# EasyEDA Pro project EMG.eprj

# Schematic schematic diagram
Create Date: 2024-07-17; Page Name: Page 1; Project Name: EMG; Schematic Name: schematic diagram; Update Date: 2024-07-18; Company: University of Leeds; Drawed: Junnan Liu; Page Size: A; Reviewed: Junnan Liu; Version: V1.0
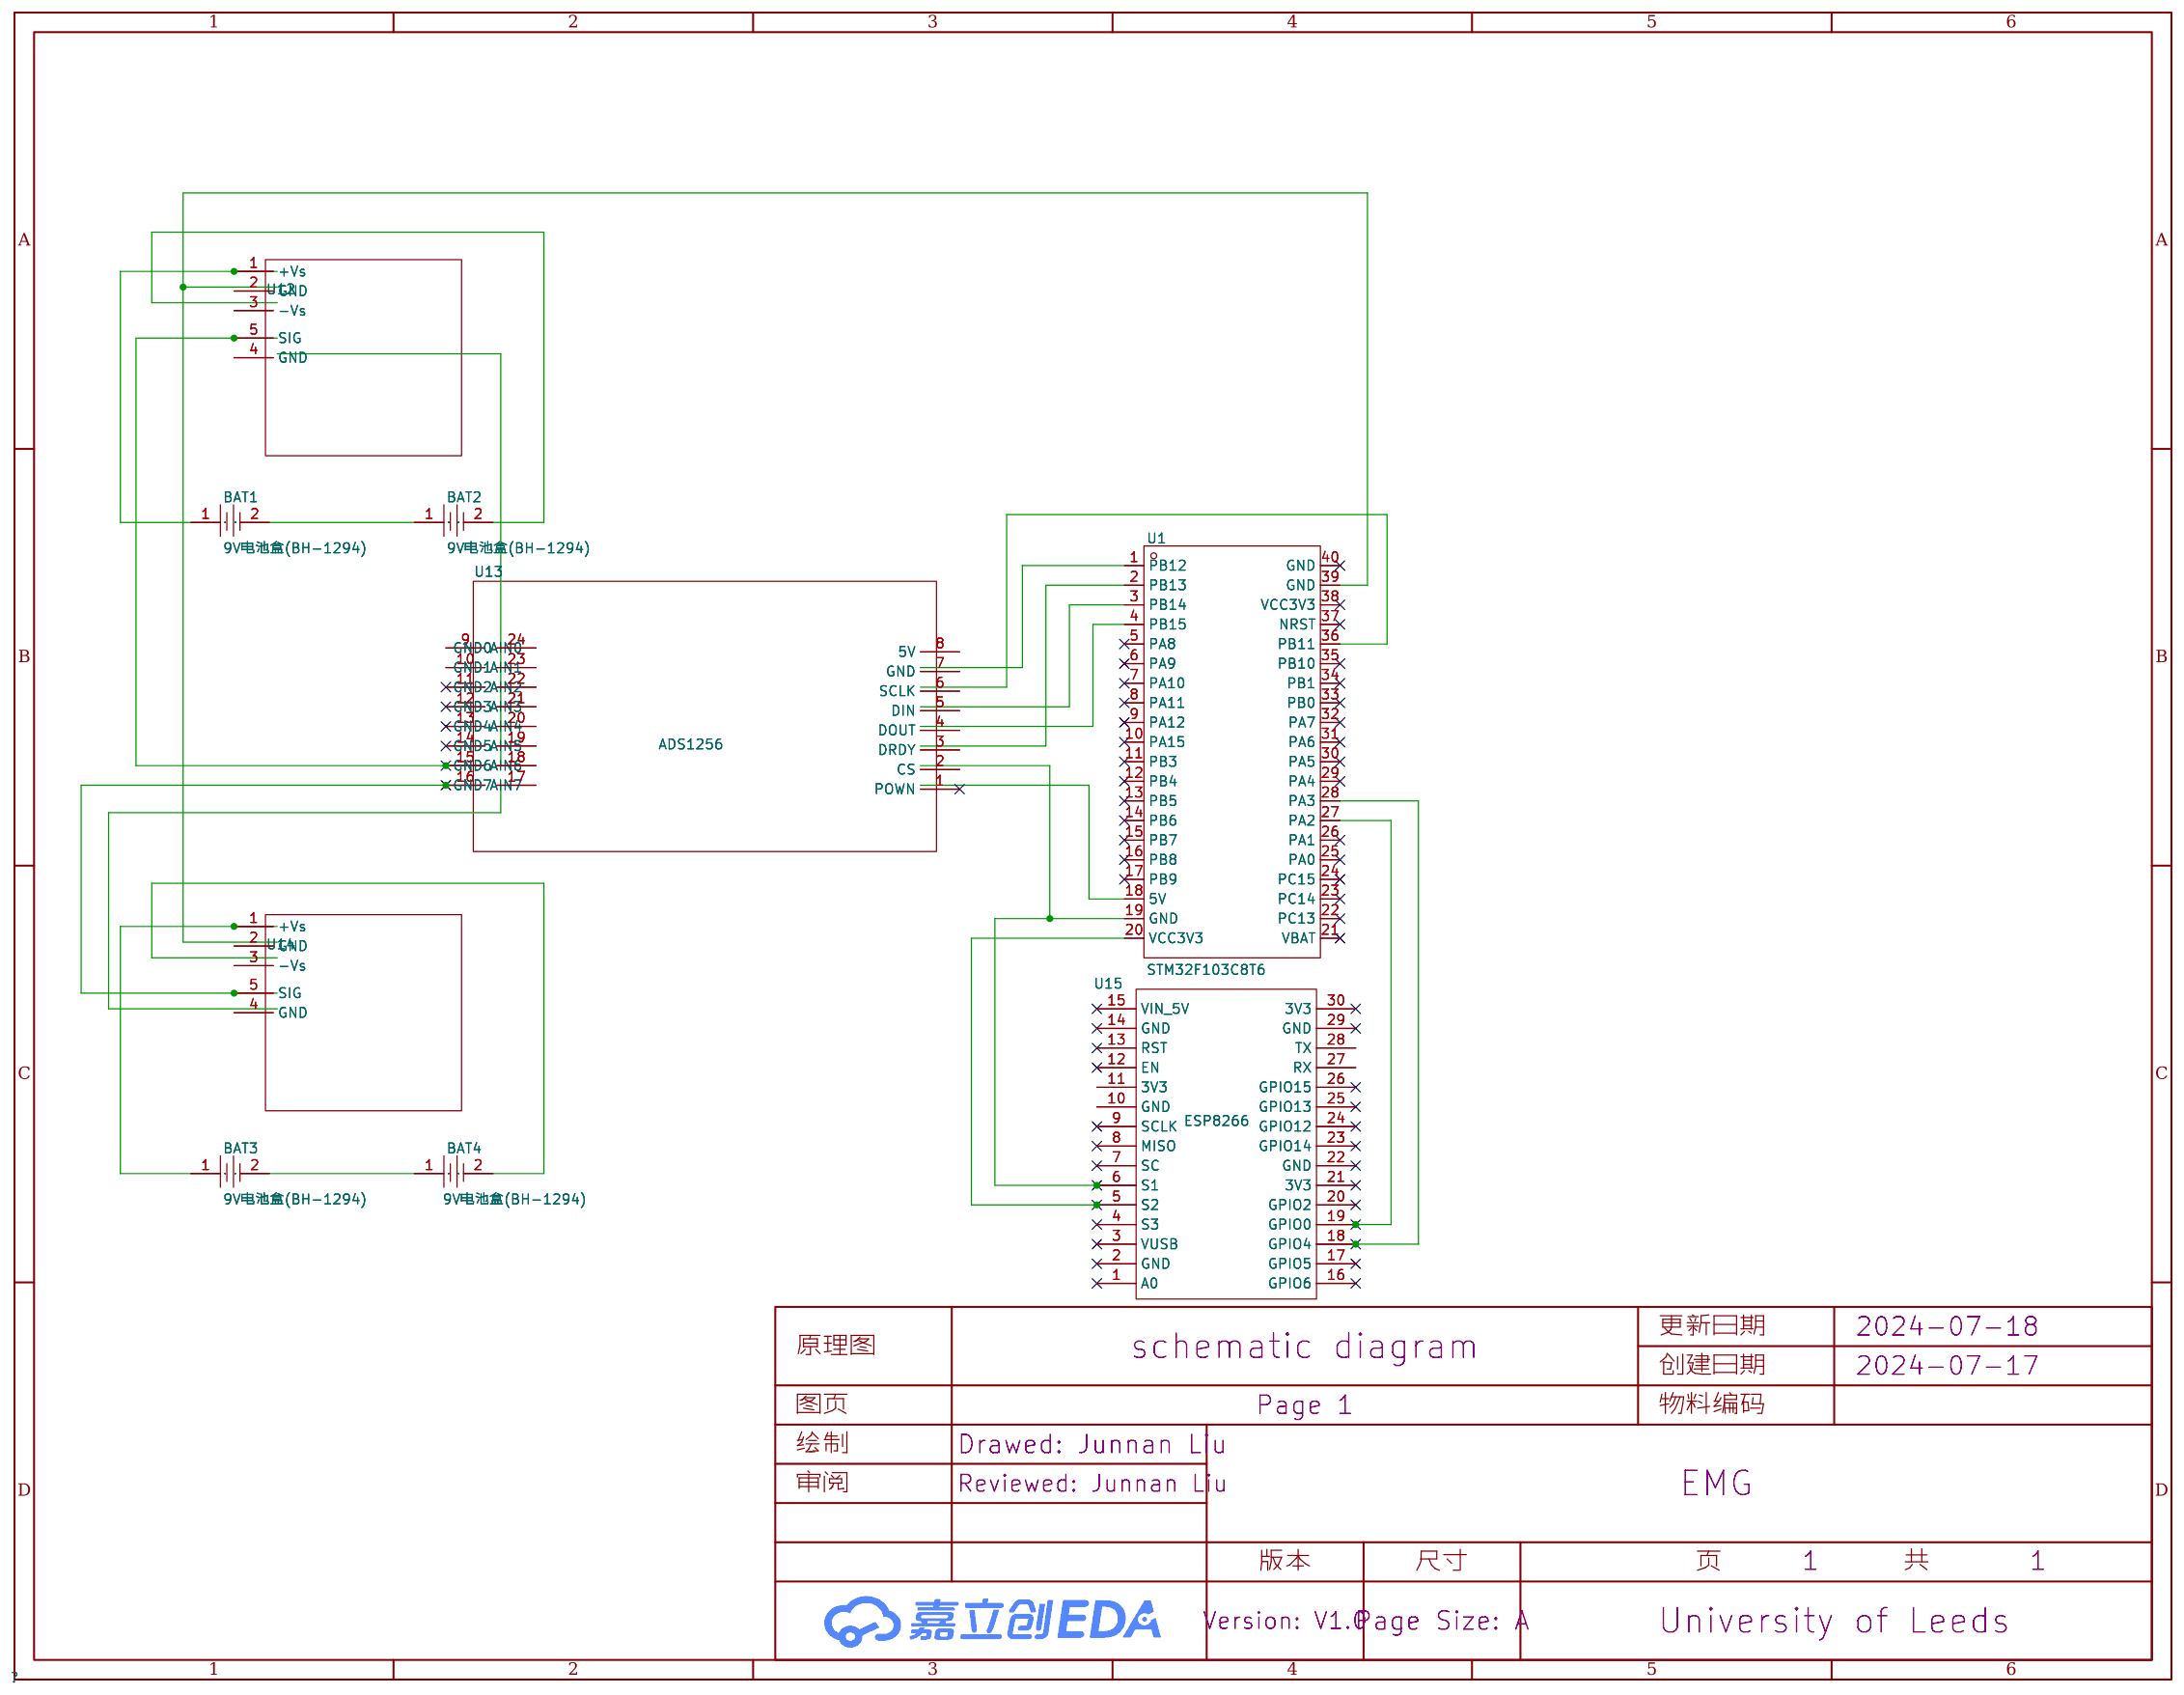
[diagram p0: schematic sheet]

## Parts
BAT1  9V电池盒(BH-1294)  [BAT-TH_BH-1294]
BAT2  9V电池盒(BH-1294)  [BAT-TH_BH-1294]
BAT3  9V电池盒(BH-1294)  [BAT-TH_BH-1294]
BAT4  9V电池盒(BH-1294)  [BAT-TH_BH-1294]
U1  STM32F103C8T6  [CONN-TH_L53.3-W22.9_STM32F103C8T6-CARD]
U12  -  [AD8226]
U13  ADS1256  [ADS1256]
U14  -  [AD8226]
U15  ESP8266  [ESP8266]

## Library data of the parts
BAT1-BAT4 = 9V电池盒(BH-1294): Supplier Part: C2848814; Supplier Footprint: TH-2P; JLCPCB Part Class: 扩展库; Supplier: LCSC
U1 = STM32F103C8T6-Card: Supplier Part: C9900077949; Supplier Footprint: 插件; Supplier: LCSC
U12 U14 = AD8226
U13 = ADS1256
U15 = ESP8266

## Nets
$1N1992: BAT1.2 BAT2.1
$1N2057: BAT1.1 U12.1(+Vs)
$1N2495: BAT3.2 BAT4.1
$1N2497: BAT3.1 U14.1(+Vs)
Net-(U1-19): U1.19(GND) U15.6(S1)
Net-(U1-20): U1.20(VCC3V3) U15.5(S2)
Net-(U1-27): U1.27(PA2) U15.19(GPIO0)
Net-(U1-28): U1.28(PA3) U15.18(GPIO4)
Net-(U12-5): U12.5(SIG) U13.15(AIN6)
Net-(U13-16): U13.16(AIN7) U14.5(SIG)

Not connected (* = marked no-connect by the designer): BAT2 2; BAT4 2; U1 1(PB12) 2(PB13) 3(PB14) 4(PB15) 5(PA8)* 6(PA9)* 7(PA10)* 8(PA11)* 9(PA12)* 10(PA15)* 11(PB3)* 12(PB4)* 13(PB5)* 14(PB6)* 15(PB7)* 16(PB8)* 17(PB9)* 18(5V) 21(VBAT)* 22(PC13)* 23(PC14)* 24(PC15)* 25(PA0)* 26(PA1)* 29(PA4)* 30(PA5)* 31(PA6)* 32(PA7)* 33(PB0)* 34(PB1)* 35(PB10)* 36(PB11) 37(NRST)* 38(VCC3V3)* 39(GND) 40(GND)*; U12 2(GND) 3(-Vs) 4(GND); U13 1(POWN)* 2(CS) 3(DRDY) 4(DOUT) 5(DIN) 6(SCLK) 7(GND) 8(5V) 9(AIN0) 10(AIN1) 11(AIN2)* 12(AIN3)* 13(AIN4)* 14(AIN5)* 17(GND7) 18(GND6) 19(GND5) 20(GND4) 21(GND3) 22(GND2) 23(GND1) 24(GND0); U14 2(GND) 3(-Vs) 4(GND); U15 1(A0)* 2(GND)* 3(VUSB)* 4(S3)* 7(SC)* 8(MISO)* 9(SCLK)* 10(GND) 11(3V3) 12(EN)* 13(RST)* 14(GND)* 15(VIN 5V)* 16(GPIO6)* 17(GPIO5)* 20(GPIO2)* 21(3V3)* 22(GND)* 23(GPIO14)* 24(GPIO12)* 25(GPIO13)* 26(GPIO15)* 27(RX) 28(TX) 29(GND)* 30(3V3)*

# Schematic Schematic1
Create Date: 2024-07-19; Page Name: P1; Project Name: EMG; Schematic Name: Schematic1; Update Date: 2024-07-19; Company: University of Leeds; Drawed: Junnan Liu; Page Size: A; Reviewed: Junnan Liu; Version: V1.0
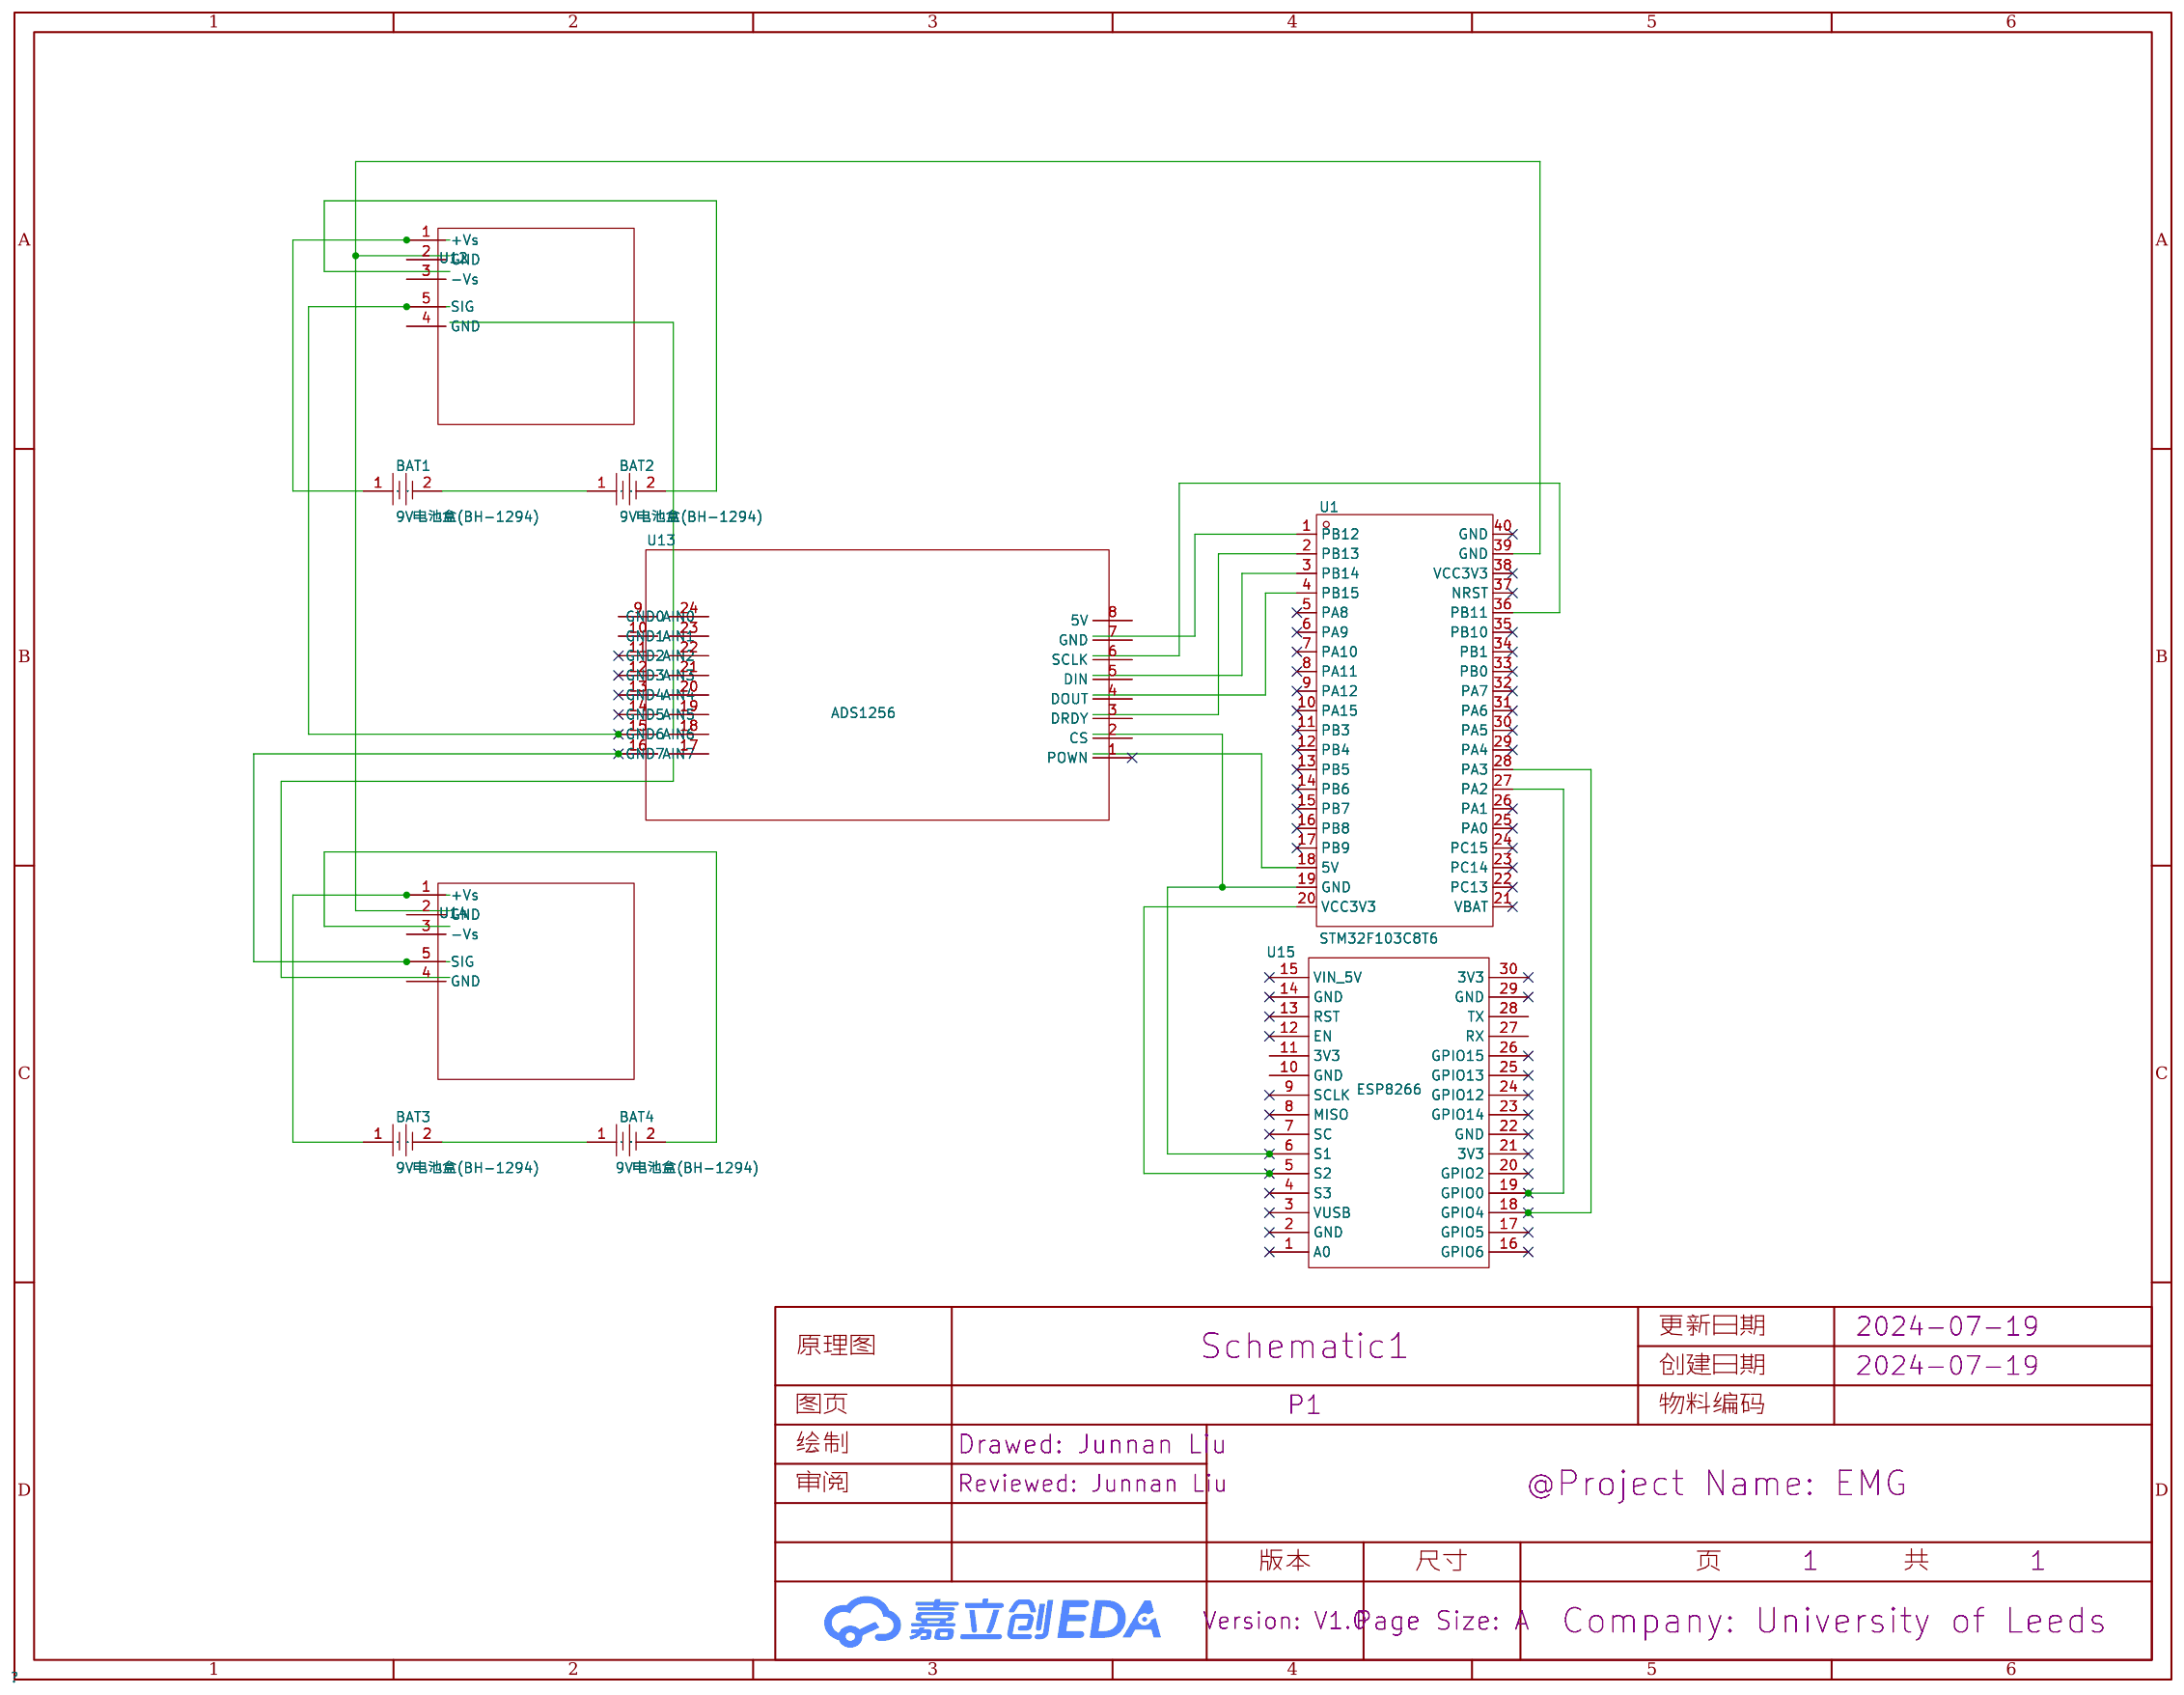
[diagram p1: schematic sheet]

## Parts
BAT1  9V电池盒(BH-1294)  [BAT-TH_BH-1294]
BAT2  9V电池盒(BH-1294)  [BAT-TH_BH-1294]
BAT3  9V电池盒(BH-1294)  [BAT-TH_BH-1294]
BAT4  9V电池盒(BH-1294)  [BAT-TH_BH-1294]
U1  STM32F103C8T6  [CONN-TH_L53.3-W22.9_STM32F103C8T6-CARD]
U12  -  [AD8226]
U13  ADS1256  [ADS1256]
U14  -  [AD8226]
U15  ESP8266  [ESP8266]

## Library data of the parts
BAT1-BAT4 = 9V电池盒(BH-1294): Supplier Part: C2848814; Supplier Footprint: TH-2P; JLCPCB Part Class: 扩展库; Supplier: LCSC
U1 = STM32F103C8T6-Card: Supplier Part: C9900077949; Supplier Footprint: 插件; Supplier: LCSC
U12 U14 = AD8226
U13 = ADS1256
U15 = ESP8266

## Nets
$1N615: BAT1.2 BAT2.1
$1N620: BAT3.2 BAT4.1
$1N621: BAT3.1 U14.1(+Vs)
$1N626: BAT1.1 U12.1(+Vs)
Net-(U1-19): U1.19(GND) U15.6(S1)
Net-(U1-20): U1.20(VCC3V3) U15.5(S2)
Net-(U1-27): U1.27(PA2) U15.19(GPIO0)
Net-(U1-28): U1.28(PA3) U15.18(GPIO4)
Net-(U12-5): U12.5(SIG) U13.15(AIN6)
Net-(U13-16): U13.16(AIN7) U14.5(SIG)

Not connected (* = marked no-connect by the designer): BAT2 2; BAT4 2; U1 1(PB12) 2(PB13) 3(PB14) 4(PB15) 5(PA8)* 6(PA9)* 7(PA10)* 8(PA11)* 9(PA12)* 10(PA15)* 11(PB3)* 12(PB4)* 13(PB5)* 14(PB6)* 15(PB7)* 16(PB8)* 17(PB9)* 18(5V) 21(VBAT)* 22(PC13)* 23(PC14)* 24(PC15)* 25(PA0)* 26(PA1)* 29(PA4)* 30(PA5)* 31(PA6)* 32(PA7)* 33(PB0)* 34(PB1)* 35(PB10)* 36(PB11) 37(NRST)* 38(VCC3V3)* 39(GND) 40(GND)*; U12 2(GND) 3(-Vs) 4(GND); U13 1(POWN)* 2(CS) 3(DRDY) 4(DOUT) 5(DIN) 6(SCLK) 7(GND) 8(5V) 9(AIN0) 10(AIN1) 11(AIN2)* 12(AIN3)* 13(AIN4)* 14(AIN5)* 17(GND7) 18(GND6) 19(GND5) 20(GND4) 21(GND3) 22(GND2) 23(GND1) 24(GND0); U14 2(GND) 3(-Vs) 4(GND); U15 1(A0)* 2(GND)* 3(VUSB)* 4(S3)* 7(SC)* 8(MISO)* 9(SCLK)* 10(GND) 11(3V3) 12(EN)* 13(RST)* 14(GND)* 15(VIN 5V)* 16(GPIO6)* 17(GPIO5)* 20(GPIO2)* 21(3V3)* 22(GND)* 23(GPIO14)* 24(GPIO12)* 25(GPIO13)* 26(GPIO15)* 27(RX) 28(TX) 29(GND)* 30(3V3)*

# Schematic Schematic2
Create Date: 2024-07-19; Page Name: P1; Project Name: EMG; Schematic Name: Schematic2; Update Date: 2024-07-24; Company: University of Leeds; Drawed: Junnan Liu; Page Size: A; Reviewed: Junnan Liu; Version: V1.0
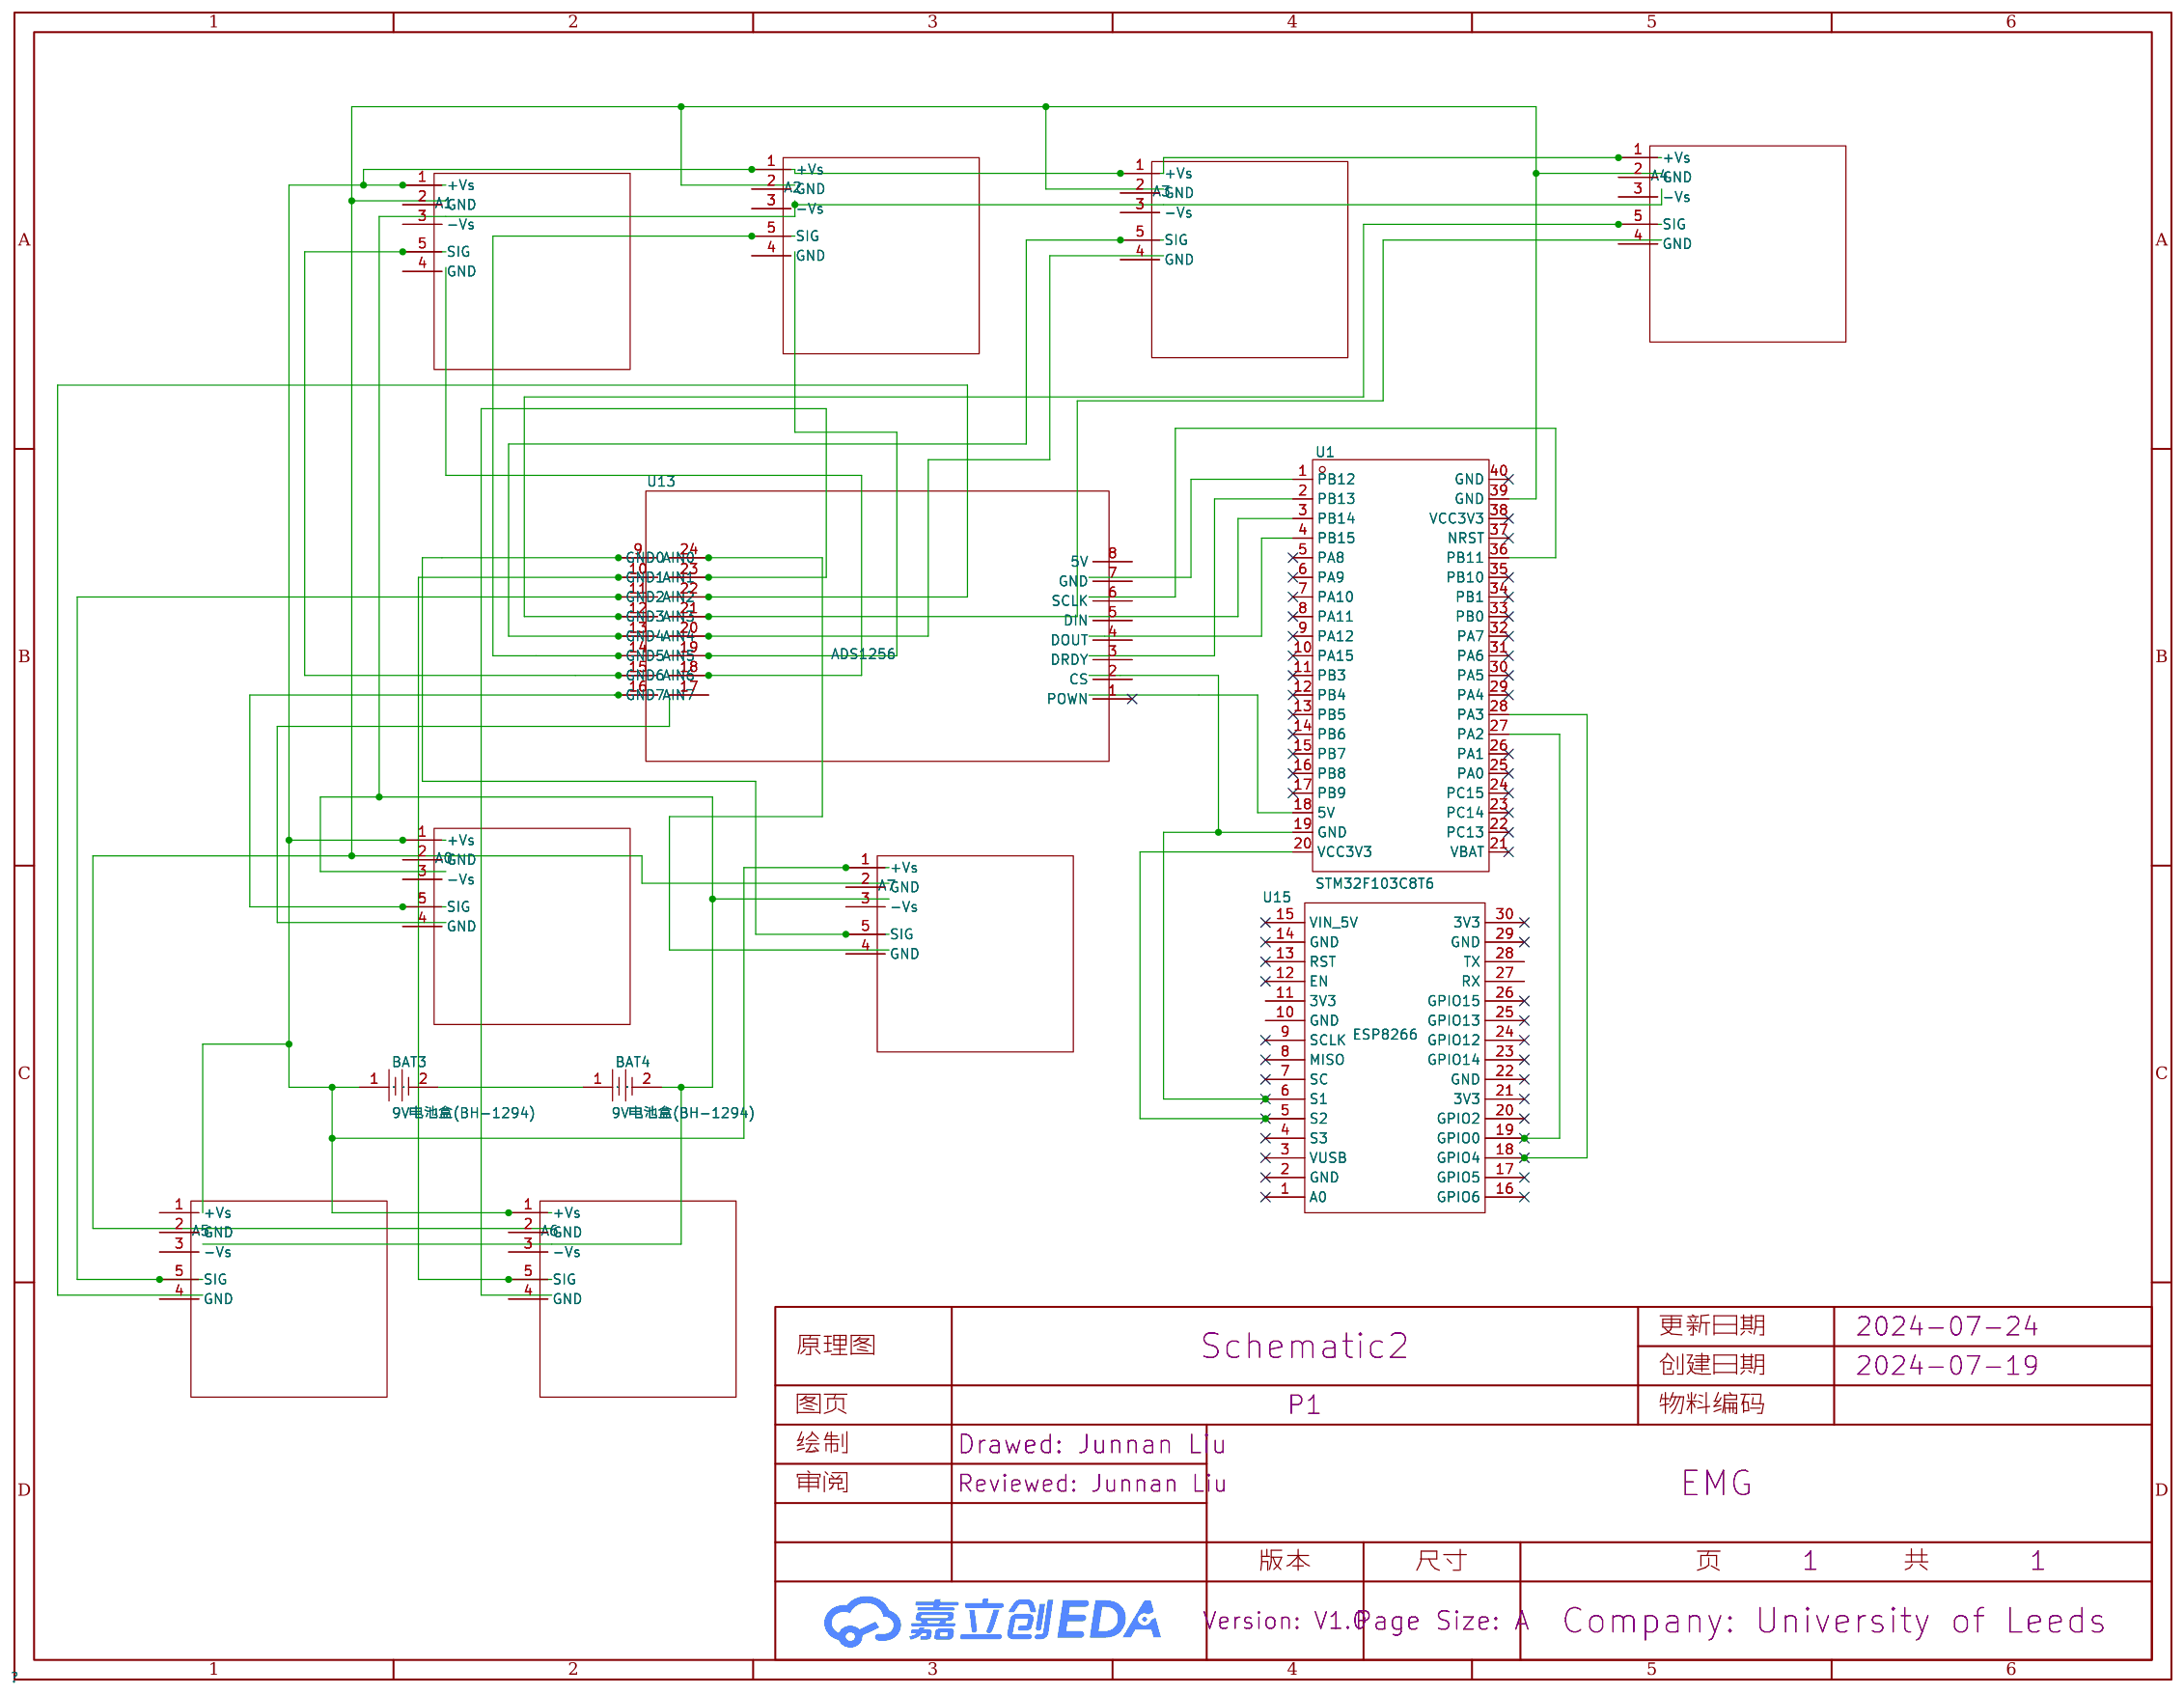
[diagram p2: schematic sheet]

## Parts
A0  -  [AD8226]
A1  -  [AD8226]
A2  -  [AD8226]
A3  -  [AD8226]
A4  -  [AD8226]
A5  -  [AD8226]
A6  -  [AD8226]
A7  -  [AD8226]
BAT3  9V电池盒(BH-1294)  [BAT-TH_BH-1294]
BAT4  9V电池盒(BH-1294)  [BAT-TH_BH-1294]
U1  STM32F103C8T6  [CONN-TH_L53.3-W22.9_STM32F103C8T6-CARD]
U13  ADS1256  [ADS1256]
U15  ESP8266  [ESP8266]

## Library data of the parts
A0-A7 = AD8226
BAT3 BAT4 = 9V电池盒(BH-1294): Supplier Part: C2848814; Supplier Footprint: TH-2P; JLCPCB Part Class: 扩展库; Supplier: LCSC
U1 = STM32F103C8T6-Card: Supplier Part: C9900077949; Supplier Footprint: 插件; Supplier: LCSC
U13 = ADS1256
U15 = ESP8266

## Nets
$1N620: BAT3.2 BAT4.1
Net-(A0-1): A0.1(+Vs) A1.1(+Vs) A2.1(+Vs) A3.1(+Vs) A4.1(+Vs) A6.1(+Vs) A7.1(+Vs) BAT3.1
Net-(A0-5): A0.5(SIG) U13.16(AIN7)
Net-(A1-5): A1.5(SIG) U13.15(AIN6)
Net-(A2-5): A2.5(SIG) U13.14(AIN5)
Net-(A3-5): A3.5(SIG) U13.13(AIN4)
Net-(A4-5): A4.5(SIG) U13.12(AIN3)
Net-(A5-5): A5.5(SIG) U13.11(AIN2)
Net-(A6-5): A6.5(SIG) U13.10(AIN1)
Net-(A7-5): A7.5(SIG) U13.9(AIN0)
Net-(U1-19): U1.19(GND) U15.6(S1)
Net-(U1-20): U1.20(VCC3V3) U15.5(S2)
Net-(U1-27): U1.27(PA2) U15.19(GPIO0)
Net-(U1-28): U1.28(PA3) U15.18(GPIO4)

Not connected (* = marked no-connect by the designer): A0 2(GND) 3(-Vs) 4(GND); A1 2(GND) 3(-Vs) 4(GND); A2 2(GND) 3(-Vs) 4(GND); A3 2(GND) 3(-Vs) 4(GND); A4 2(GND) 3(-Vs) 4(GND); A5 1(+Vs) 2(GND) 3(-Vs) 4(GND); A6 2(GND) 3(-Vs) 4(GND); A7 2(GND) 3(-Vs) 4(GND); BAT4 2; U1 1(PB12) 2(PB13) 3(PB14) 4(PB15) 5(PA8)* 6(PA9)* 7(PA10)* 8(PA11)* 9(PA12)* 10(PA15)* 11(PB3)* 12(PB4)* 13(PB5)* 14(PB6)* 15(PB7)* 16(PB8)* 17(PB9)* 18(5V) 21(VBAT)* 22(PC13)* 23(PC14)* 24(PC15)* 25(PA0)* 26(PA1)* 29(PA4)* 30(PA5)* 31(PA6)* 32(PA7)* 33(PB0)* 34(PB1)* 35(PB10)* 36(PB11) 37(NRST)* 38(VCC3V3)* 39(GND) 40(GND)*; U13 1(POWN)* 2(CS) 3(DRDY) 4(DOUT) 5(DIN) 6(SCLK) 7(GND) 8(5V) 17(GND7) 18(GND6) 19(GND5) 20(GND4) 21(GND3) 22(GND2) 23(GND1) 24(GND0); U15 1(A0)* 2(GND)* 3(VUSB)* 4(S3)* 7(SC)* 8(MISO)* 9(SCLK)* 10(GND) 11(3V3) 12(EN)* 13(RST)* 14(GND)* 15(VIN 5V)* 16(GPIO6)* 17(GPIO5)* 20(GPIO2)* 21(3V3)* 22(GND)* 23(GPIO14)* 24(GPIO12)* 25(GPIO13)* 26(GPIO15)* 27(RX) 28(TX) 29(GND)* 30(3V3)*

# Schematic Schematic3
Create Date: 2024-07-24; Page Name: P1; Project Name: EMG; Schematic Name: Schematic3; Update Date: 2024-07-24; Company: University of Leeds; Drawed: Junnan Liu; Page Size: A; Reviewed: Junnan Liu; Version: V1.0
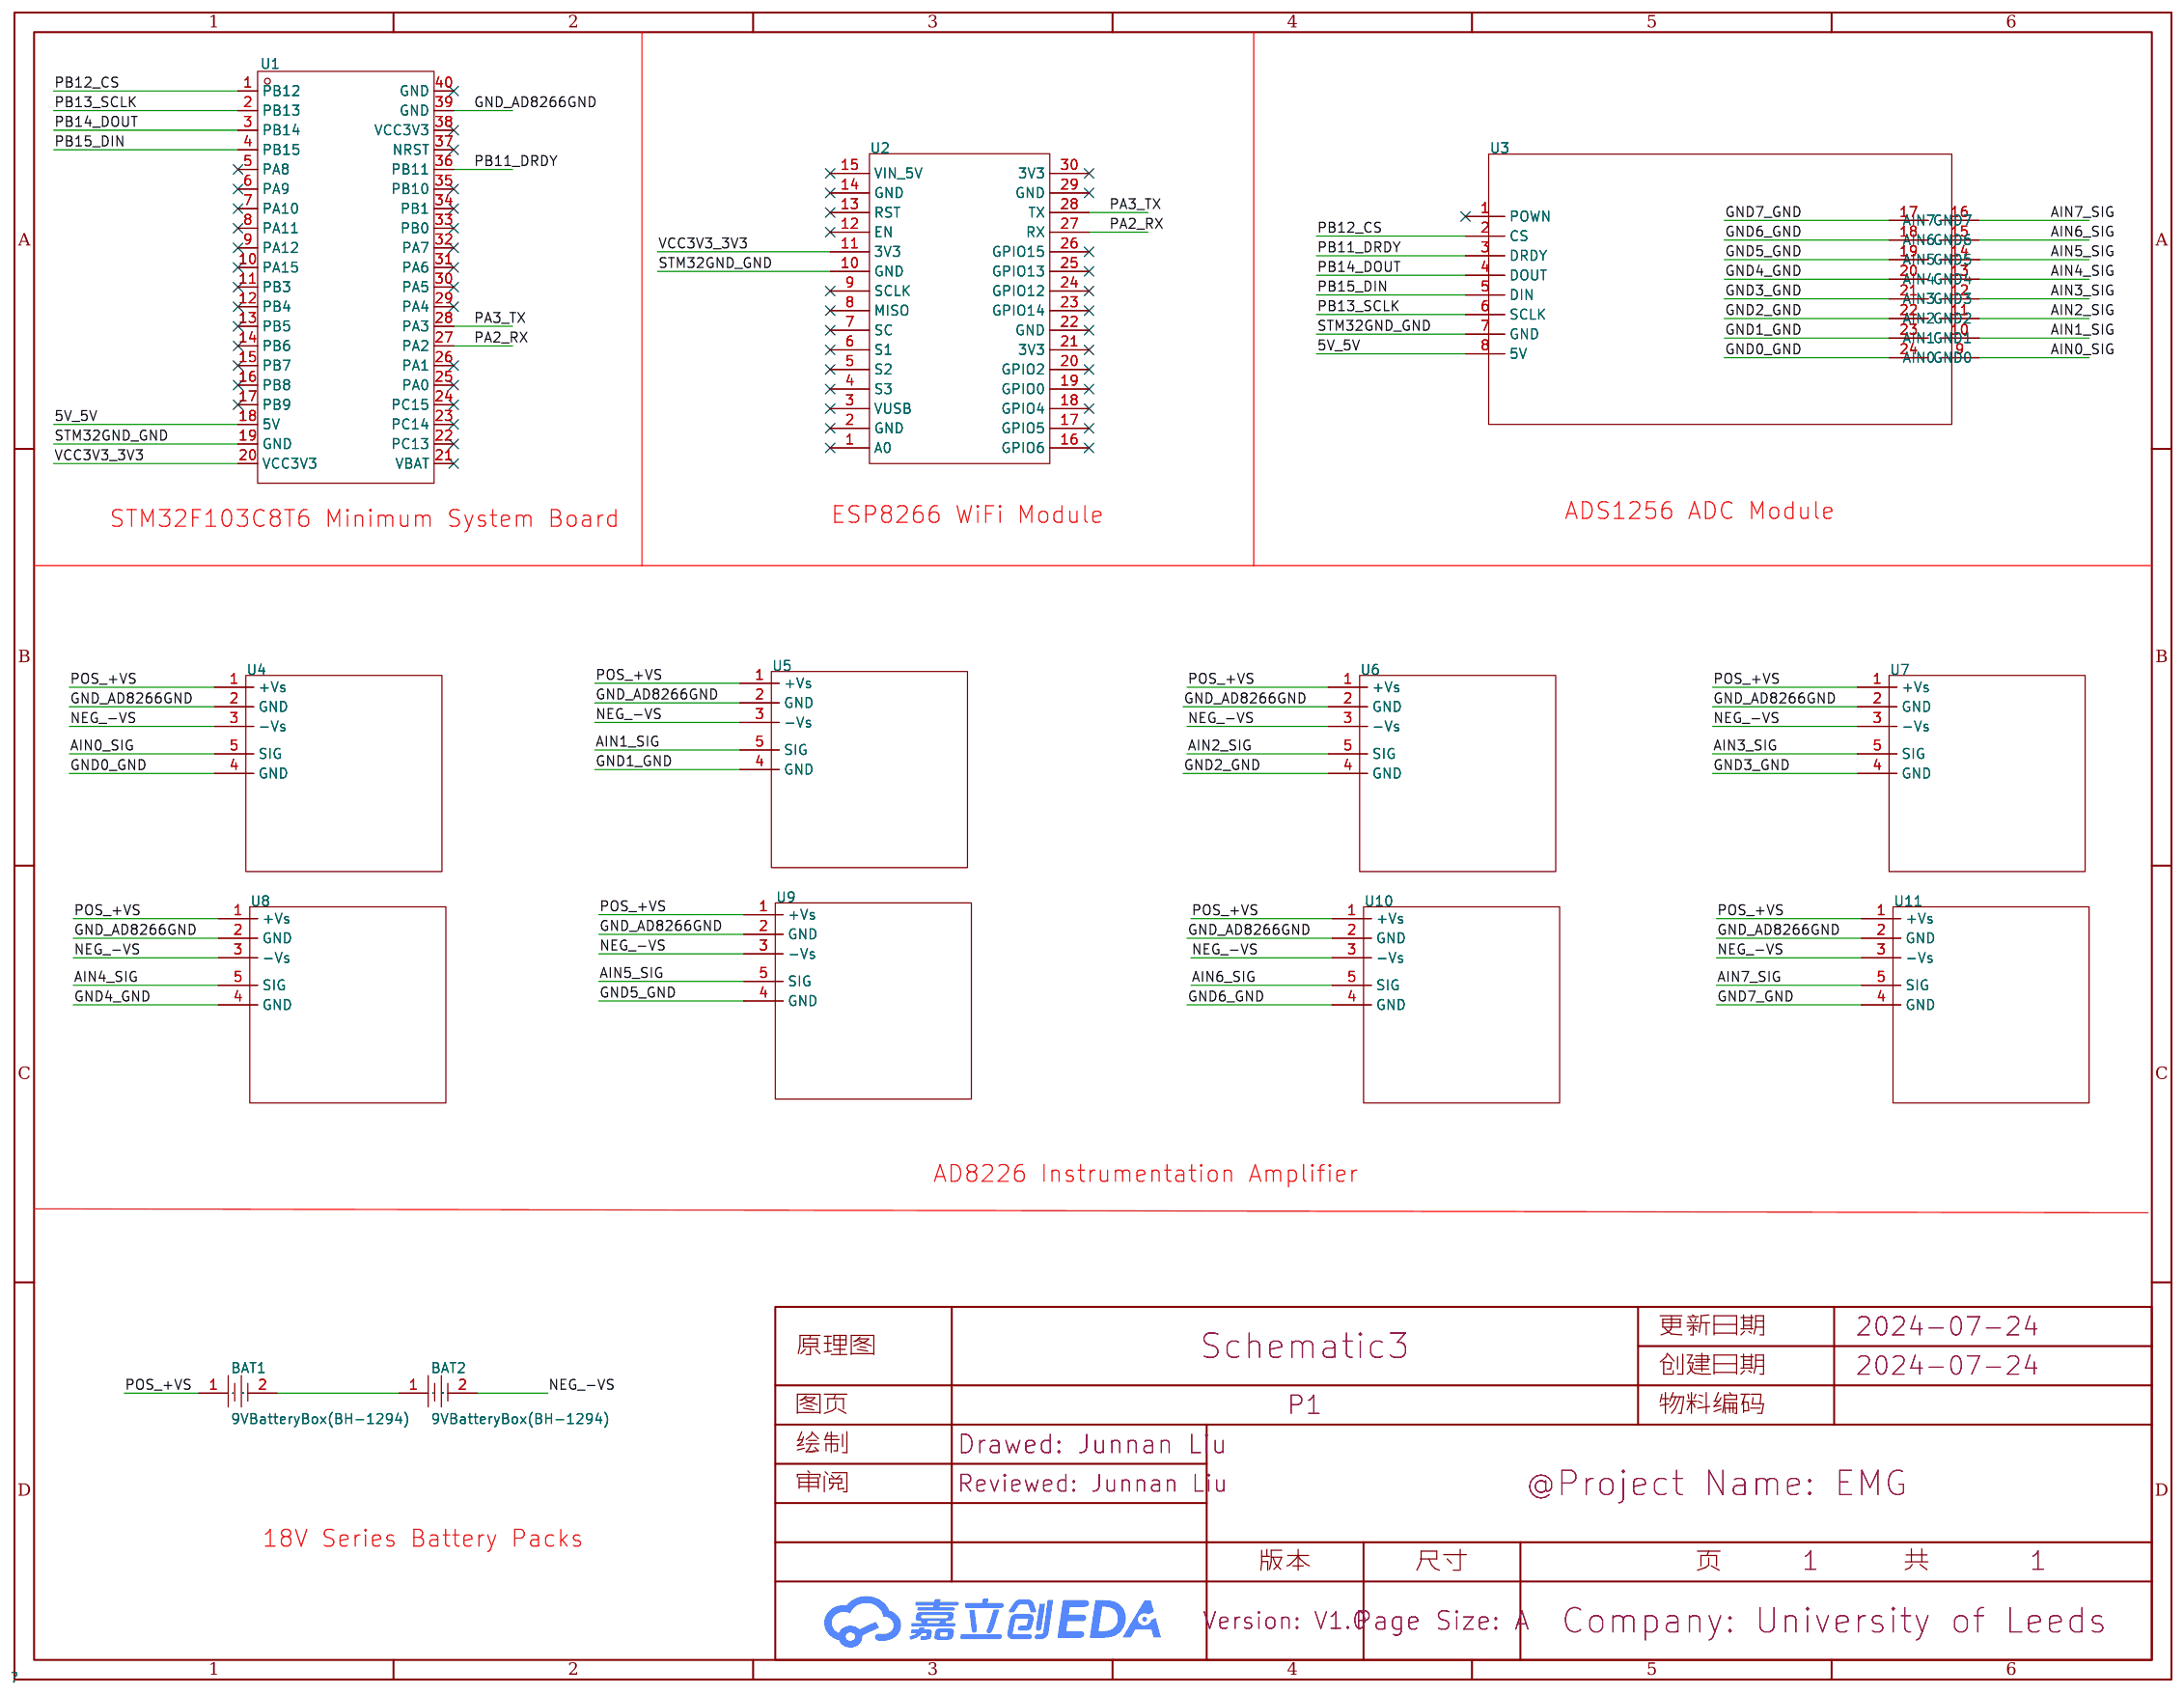
[diagram p3: schematic sheet]

## Parts
BAT1  9VBatteryBox(BH-1294)  [BAT-TH_BH-1294]
BAT2  9VBatteryBox(BH-1294)  [BAT-TH_BH-1294]
U1  STM32F103C8T6-Card  [CONN-TH_L53.3-W22.9_STM32F103C8T6-CARD]
U2  -  [ESP8266]
U3  -  [ADS1256]
U4  -  [AD8226]
U5  -  [AD8226]
U6  -  [AD8226]
U7  -  [AD8226]
U8  -  [AD8226]
U9  -  [AD8226]
U10  -  [AD8226]
U11  -  [AD8226]

## Library data of the parts
BAT1 BAT2 = 9VBatteryBox(BH-1294): LCSC Part Name: 9V电池盒(BH-1294); Supplier Part: C2848814; Supplier Footprint: TH-2P; JLCPCB Part Class: 扩展库; Supplier: LCSC
U1 = STM32F103C8T6-Card: Supplier Part: C9900077949; Supplier Footprint: 插件; Supplier: LCSC
U2 = ESP8266
U3 = ADS1256
U4-U11 = AD8226

## Nets
5V_5V: U1.18(5V) U3.8(5V)
GND0_GND: U3.24(GND0) U4.4(GND)
GND1_GND: U3.23(GND1) U5.4(GND)
GND2_GND: U3.22(GND2) U6.4(GND)
GND3_GND: U3.21(GND3) U7.4(GND)
GND4_GND: U3.20(GND4) U8.4(GND)
GND5_GND: U3.19(GND5) U9.4(GND)
GND6_GND: U3.18(GND6) U10.4(GND)
GND7_GND: U3.17(GND7) U11.4(GND)
GND_AD8266GND: U1.39(GND) U4.2(GND) U5.2(GND) U6.2(GND) U7.2(GND) U8.2(GND) U9.2(GND) U10.2(GND) U11.2(GND)
VCC3V3_3V3: U1.20(VCC3V3) U2.11(3V3)
AIN0_SIG: U3.9(AIN0) U4.5(SIG)
AIN1_SIG: U3.10(AIN1) U5.5(SIG)
AIN2_SIG: U3.11(AIN2) U6.5(SIG)
AIN3_SIG: U3.12(AIN3) U7.5(SIG)
AIN4_SIG: U3.13(AIN4) U8.5(SIG)
AIN5_SIG: U3.14(AIN5) U9.5(SIG)
AIN6_SIG: U3.15(AIN6) U10.5(SIG)
AIN7_SIG: U3.16(AIN7) U11.5(SIG)
NEG_-VS: BAT2.2 U4.3(-Vs) U5.3(-Vs) U6.3(-Vs) U7.3(-Vs) U8.3(-Vs) U9.3(-Vs) U10.3(-Vs) U11.3(-Vs)
PA2_RX: U1.27(PA2) U2.27(RX)
PA3_TX: U1.28(PA3) U2.28(TX)
PB11_DRDY: U1.36(PB11) U3.3(DRDY)
PB12_CS: U1.1(PB12) U3.2(CS)
PB13_SCLK: U1.2(PB13) U3.6(SCLK)
PB14_DOUT: U1.3(PB14) U3.4(DOUT)
PB15_DIN: U1.4(PB15) U3.5(DIN)
POS_+VS: BAT1.1 U4.1(+Vs) U5.1(+Vs) U6.1(+Vs) U7.1(+Vs) U8.1(+Vs) U9.1(+Vs) U10.1(+Vs) U11.1(+Vs)
STM32GND_GND: U1.19(GND) U2.10(GND) U3.7(GND)
$1N6178: BAT1.2 BAT2.1

Not connected (* = marked no-connect by the designer): U1 5(PA8)* 6(PA9)* 7(PA10)* 8(PA11)* 9(PA12)* 10(PA15)* 11(PB3)* 12(PB4)* 13(PB5)* 14(PB6)* 15(PB7)* 16(PB8)* 17(PB9)* 21(VBAT)* 22(PC13)* 23(PC14)* 24(PC15)* 25(PA0)* 26(PA1)* 29(PA4)* 30(PA5)* 31(PA6)* 32(PA7)* 33(PB0)* 34(PB1)* 35(PB10)* 37(NRST)* 38(VCC3V3)* 40(GND)*; U2 1(A0)* 2(GND)* 3(VUSB)* 4(S3)* 5(S2)* 6(S1)* 7(SC)* 8(MISO)* 9(SCLK)* 12(EN)* 13(RST)* 14(GND)* 15(VIN 5V)* 16(GPIO6)* 17(GPIO5)* 18(GPIO4)* 19(GPIO0)* 20(GPIO2)* 21(3V3)* 22(GND)* 23(GPIO14)* 24(GPIO12)* 25(GPIO13)* 26(GPIO15)* 29(GND)* 30(3V3)*; U3 1(POWN)*

## Notes on the sheet
- STM32F103C8T6 Minimum System Board
- ESP8266 WiFi Module
- ADS1256 ADC Module
- AD8226 Instrumentation Amplifier
- 18V Series Battery Packs

# Board PCB1
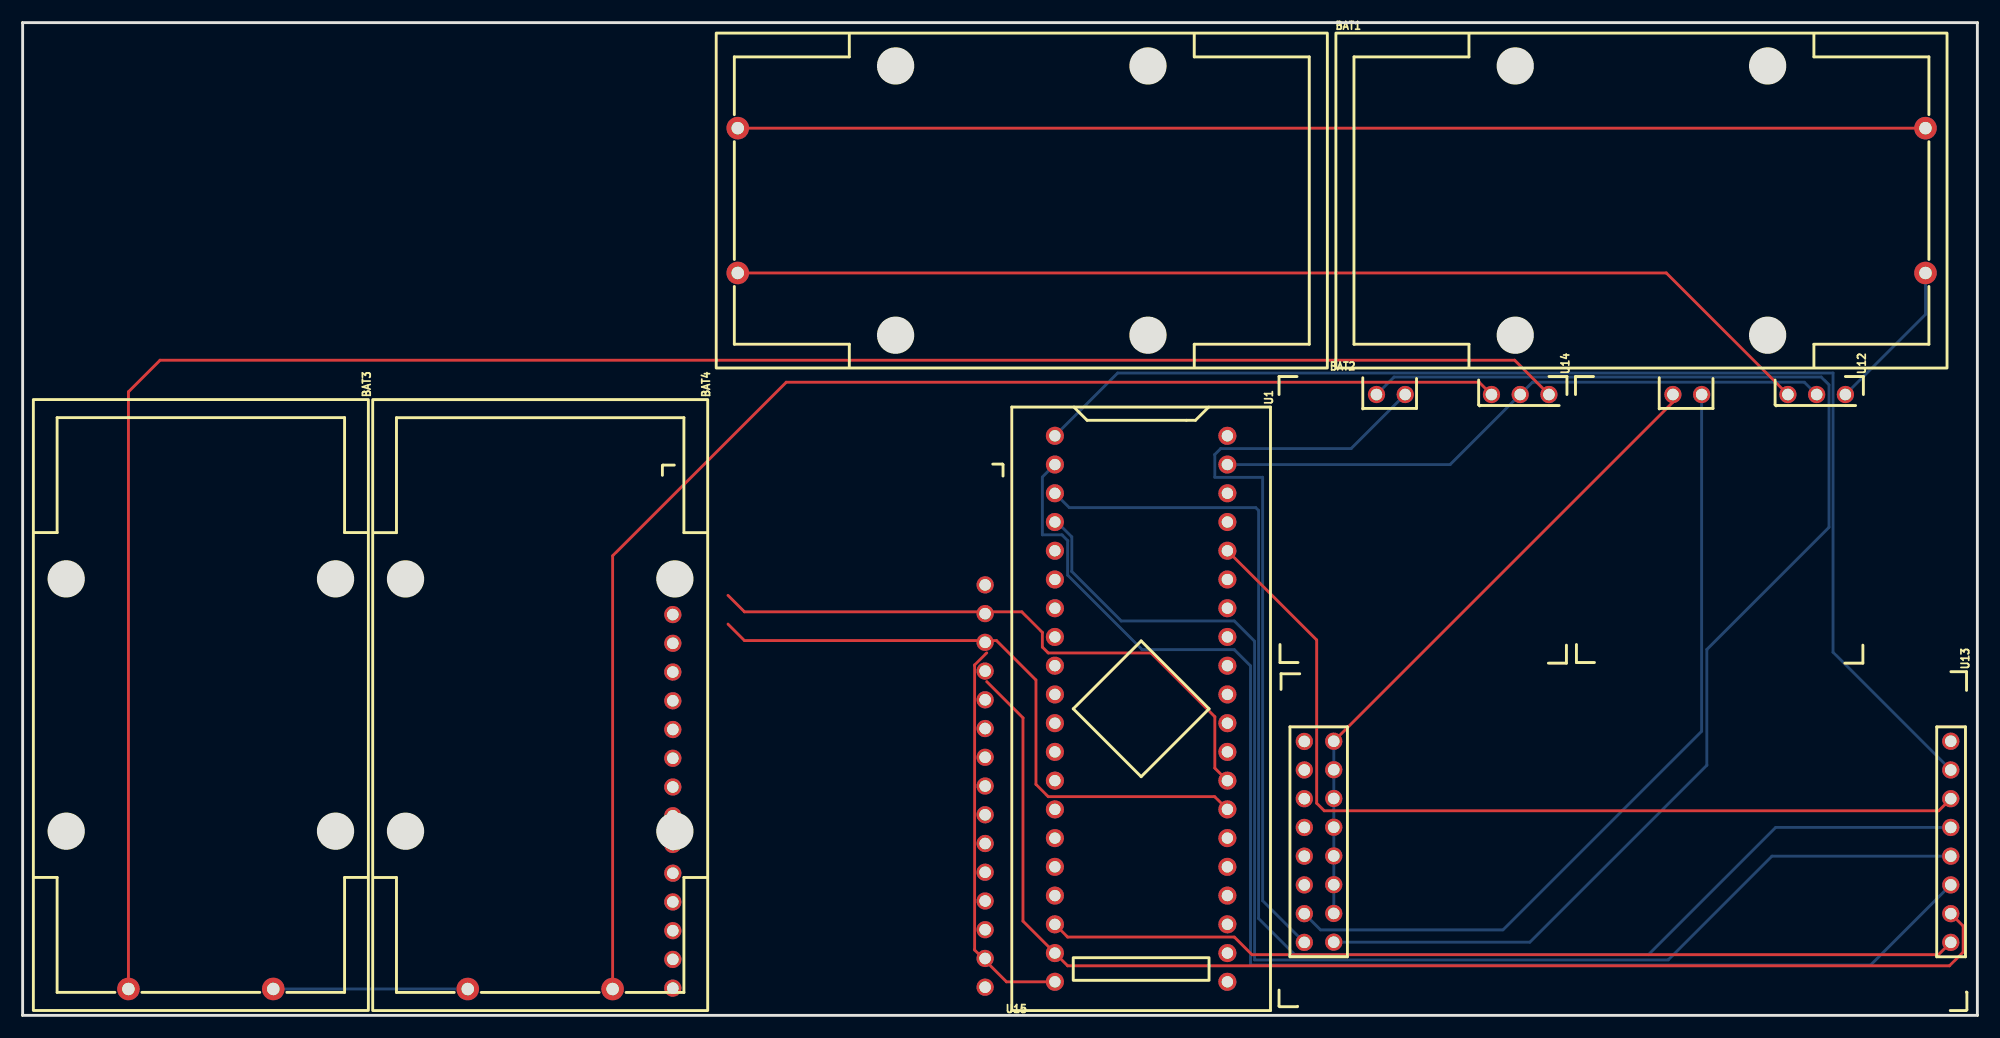
[diagram p4: board, top side]
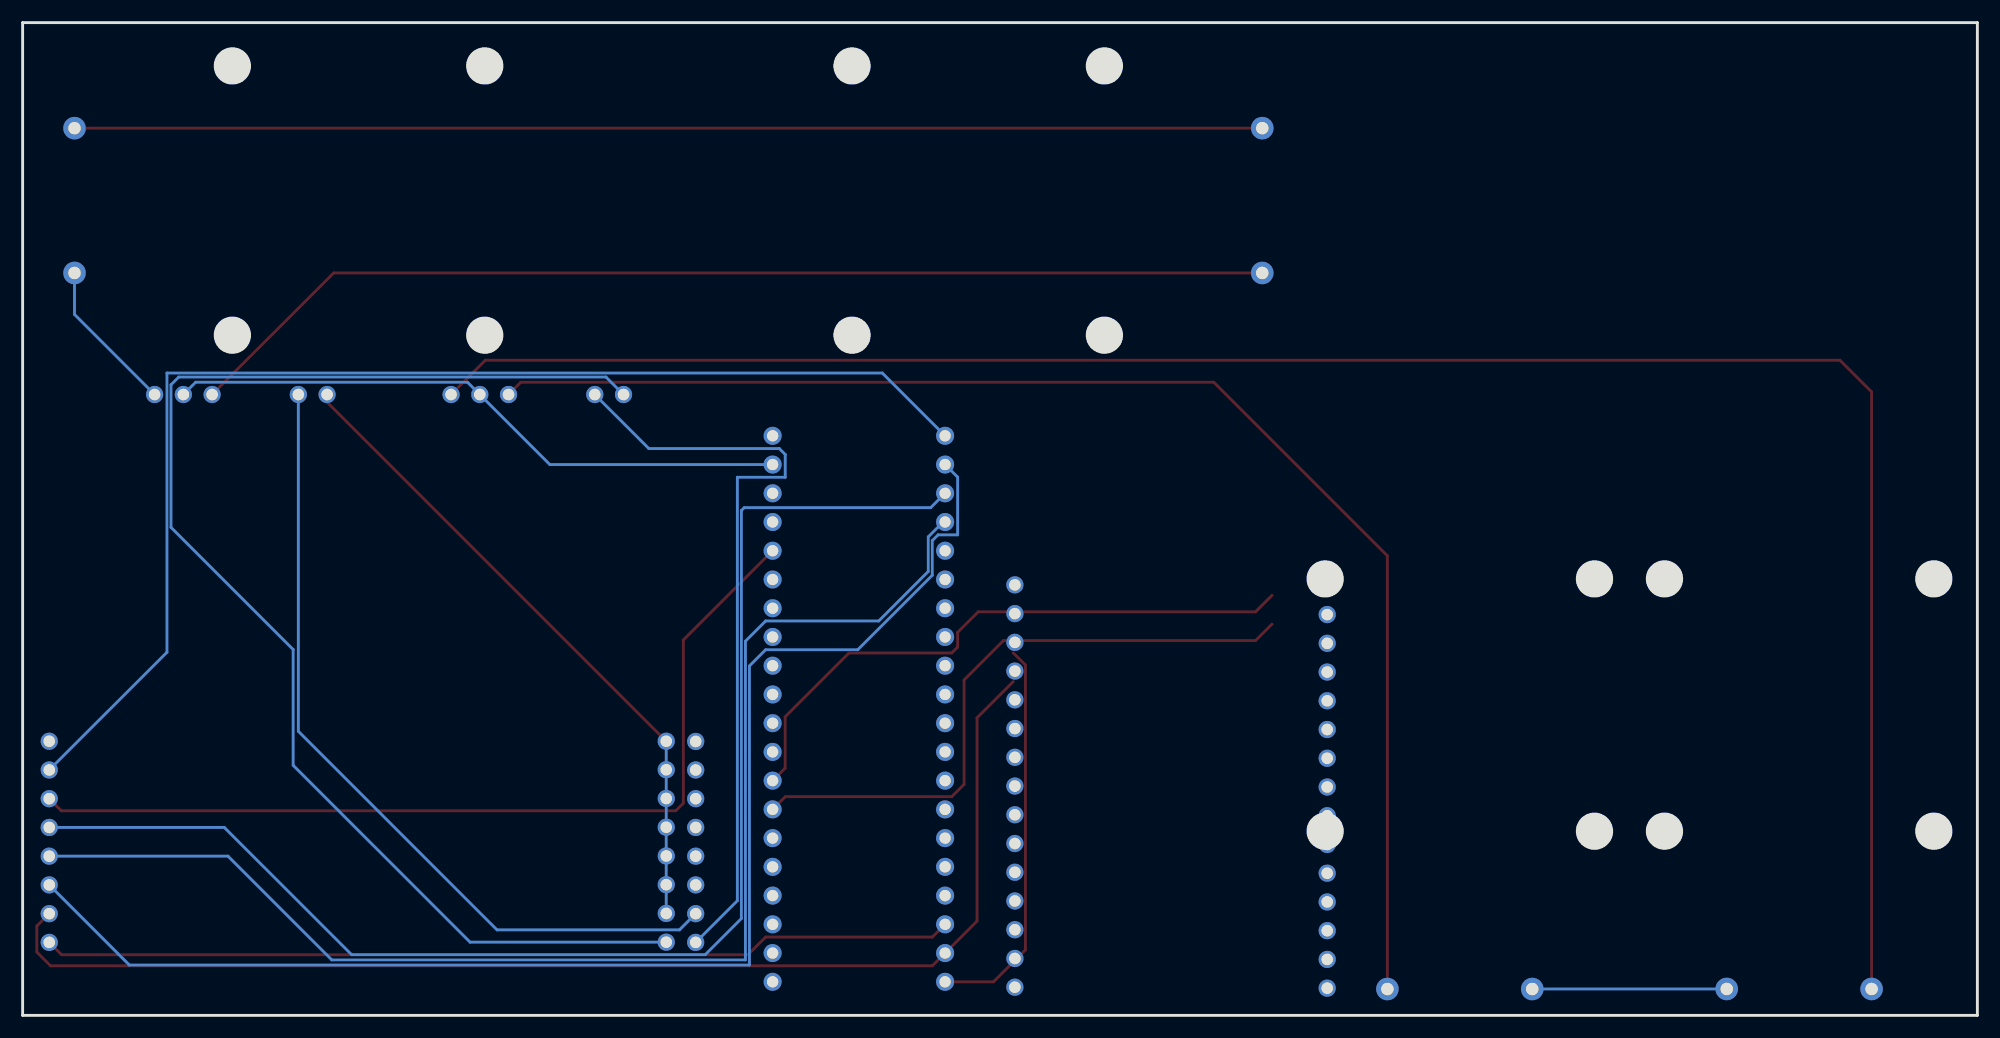
[diagram p5: board, bottom side, seen from below]

Outline 172.72 x 87.75 mm; copper layers: Top Layer, Bottom Layer. Coordinates in mm from the lower left corner of the outline.
Outline path: 0,87.75 172.72,87.75 172.72,0 0,0 0,87.75
Stack: Top Layer 0.035mm / Dielectric1 1.51mm FR4 er 4.5 / Bottom Layer 0.035mm

## Design rules (mm)
template: JLCPCB Capability(Two Layers Board)
spacing copperThickness1oz (default): track to track 0.102, other pairs 0.152 to 0.3
spacing copperThickness2oz: track to track 0.203, other pairs 0.152 to 0.3
track width copperThickness1oz (default): min 0.127, default 0.254, max 2.54
track width copperThickness2oz: min 0.203, default 0.254, max 2.54
differential pair differentialPair (default): width min 0.127, default 0.254, max 2.54; gap min 0.152, default 0.152
via viaSize (default): diameter min 0.5, default 0.61, max 10; hole min 0.3, default 0.305, max 6.3

## Placement (name value [footprint] x y rotation side)
BAT1  9V电池盒(BH-1294)  [BAT-TH_BH-1294]  168.14 72.02 0 top
BAT2  9V电池盒(BH-1294)  [BAT-TH_BH-1294]  63.19 72.02 180 top
BAT3  9V电池盒(BH-1294)  [BAT-TH_BH-1294]  15.75 2.33 270 top
BAT4  9V电池盒(BH-1294)  [BAT-TH_BH-1294]  45.73 2.33 270 top
U1  STM32F103C8T6  [CONN-TH_L53.3-W22.9_STM32F103C8T6-CARD]  98.83 27.1 270 top
U12  -  [AD8226]  162.65 56.47 270 top
U13  -  [ADS1256]  164.05 24.23 270 top
U14  -  [AD8226]  136.46 56.47 270 top
U15  -  [ESP8266]  86.67 48.71 180 top

## Footprints (pads in the part's own frame, mm; a bottom-side part is the same pattern mirrored in y, then rotated)
AD8226
  round 1.524 hole 1.02: 1(1.59,-1.59) 2(1.59,-4.13) 3(1.59,-6.67) 4(1.59,-14.29) 5(1.59,-16.83)
ADS1256
  round 1.524 hole 1.02: 1(0,6.322) 2(2.54,6.322) 3(5.08,6.322) 4(7.62,6.322) 5(10.16,6.322) 6(12.7,6.322) 7(15.24,6.322) 8(17.78,6.322) 9(17.78,-50.8) 10(15.24,-50.8) 11(12.7,-50.8) 12(10.16,-50.8) 13(7.62,-50.8) 14(5.08,-50.8) 15(2.54,-50.8) 16(0.019,-50.801) 17(0,-48.198) 18(2.521,-48.197) 19(5.061,-48.197) 20(7.601,-48.197) 21(10.141,-48.197) 22(12.681,-48.197) 23(15.221,-48.197) 24(17.761,-48.197)
BAT-TH_BH-1294
  round 2 hole 1.1: 1(0,-6.4) 2(0,6.4)
CONN-TH_L53.3-W22.9_STM32F103C8T6-CARD
  round 1.6 hole 1: 1(-24.13,-7.62) 2(-21.59,-7.62) 3(-19.05,-7.62) 4(-16.51,-7.62) 5(-13.97,-7.62) 6(-11.43,-7.62) 7(-8.89,-7.62) 8(-6.35,-7.62) 9(-3.81,-7.62) 10(-1.27,-7.62) 11(1.27,-7.62) 12(3.81,-7.62) 13(6.35,-7.62) 14(8.89,-7.62) 15(11.43,-7.62) 16(13.97,-7.62) 17(16.51,-7.62) 18(19.05,-7.62) 19(21.59,-7.62) 20(24.13,-7.62) 21(24.13,7.62) 22(21.59,7.62) 23(19.05,7.62) 24(16.51,7.62) 25(13.97,7.62) 26(11.43,7.62) 27(8.89,7.62) 28(6.35,7.62) 29(3.81,7.62) 30(1.27,7.62) 31(-1.27,7.62) 32(-3.81,7.62) 33(-6.35,7.62) 34(-8.89,7.62) 35(-11.43,7.62) 36(-13.97,7.62) 37(-16.51,7.62) 38(-19.05,7.62) 39(-21.59,7.62) 40(-24.13,7.62)
ESP8266
  round 1.524 hole 1.02: 1(1.627,46.221) 2(1.627,43.681) 3(1.627,41.141) 4(1.627,38.6) 5(1.627,36.06) 6(1.627,33.52) 7(1.627,30.98) 8(1.627,28.441) 9(1.627,25.901) 10(1.627,23.36) 11(1.627,20.82) 12(1.627,18.28) 13(1.627,15.741) 14(1.627,13.2) 15(1.627,10.661) 16(29.221,46.306) 17(29.221,43.766) 18(29.221,41.225) 19(29.221,38.685) 20(29.221,36.145) 21(29.221,33.605) 22(29.221,31.066) 23(29.221,28.526) 24(29.221,25.985) 25(29.221,23.445) 26(29.221,20.905) 27(29.221,18.366) 28(29.221,15.825) 29(29.221,13.286) 30(29.221,10.745)

## Nets
$1N1992: BAT1.2 BAT2.1
$1N2057: BAT1.1 U12.1
$1N2072: BAT2.2 U12.3
$1N2338: U1.18 U13.8
$1N2361: U1.4 U13.5
$1N2366: U1.3 U13.4
$1N2371: U1.36 U13.3
$1N2495: BAT3.2 BAT4.1
$1N2497: BAT3.1 U14.1
$1N2502: BAT4.2 U14.3
$1N2512: U1.39 U12.2 U14.2
$1N2537: U13.9 U14.4
$1N2549: U13.24 U14.5
$1N2573: U12.4 U13.10
$1N2895: U12.5 U13.17 U13.18 U13.19 U13.20 U13.21 U13.22 U13.23
$1N2929: U1.2 U13.6
$1N2939: U1.1 U13.2
$1N4322: U1.20 U15.11
$1N4327: U1.19 U13.7 U15.10
$1N4839: U1.27 U15.27
$1N4844: U1.28 U15.28

Pads without a net: U1 5 6 7 8 9 10 11 12 13 14 15 16 17 21 22 23 24 25 26 29 30 31 32 33 34 35 37 38 40; U13 1 11 12 13 14 15 16; U15 1 2 3 4 5 6 7 8 9 12 13 14 15 16 17 18 19 20 21 22 23 24 25 26 29 30

## Routing (per net, layer and track width the routed paths; a pad name or vN(x,y) marks a point on that pad's centre or on a via; arc(x,y) is an arc through that point)
$1N1992: length 105
  Top Layer w0.254: BAT1.2 BAT2.1
$1N2057: length 13.7
  Bottom Layer w0.254: U12.1 168.14,61.95 168.14,65.62
$1N2072: length 97.2
  Top Layer w0.254: U12.3 145.24,65.62 BAT2.2
$1N2338: length 80.7
  Top Layer w0.254: U1.18 92.34,6.92 107.06,6.92 108.62,5.36 169.28,5.36 U13.8
$1N2361: length 117.3
  Bottom Layer w0.254: U13.5 154.57,14.07 145.41,4.91 108.86,4.91 108.86,33.07 107.07,34.86 97.07,34.86 92.7,39.23 92.7,42.29 91.39,43.61 U1.4
$1N2366: length 121.8
  Bottom Layer w0.254: U13.4 154.9,16.61 143.65,5.36 112.41,5.36 109.21,8.56 109.21,44.62 108.96,44.88 92.48,44.88 U1.3
$1N2371: length 82.3
  Top Layer w0.254: U13.3 169.3,18.08 115.01,18.08 114.34,18.75 114.34,33.18 U1.36
$1N2497: length 180.7
  Top Layer w0.254: BAT3.1 9.35,55.12 12.14,57.91 131.83,57.91 U14.1
$1N2502: length 122.8
  Top Layer w0.254: U14.3 128.7,55.96 67.47,55.96 52.13,40.62 BAT4.2
$1N2512: length 55.5
  Bottom Layer w0.254: U12.2 157.43,55.96 133.41,55.96 U14.2 126.14,48.69 U1.39
$1N2537: length 67.9
  Bottom Layer w0.254: U14.4 117.39,50.1 105.86,50.1 105.34,49.57 105.34,47.56 109.57,47.56 109.57,10.13 U13.9
$1N2549: length 118.5
  Bottom Layer w0.254: U13.24 133.18,6.47 148.82,22.11 148.82,32.34 159.61,43.14 159.61,55.73 158.93,56.42 121.17,56.42 U14.5
$1N2573: length 72.7
  Bottom Layer w0.254: U13.10 114.68,7.56 130.8,7.56 148.36,25.11 U12.4
$1N2895: length 58.3
  Top Layer w0.254: U13.17 145.82,54.2 U12.5
  Bottom Layer w0.254: U13.23 U13.22 U13.21 U13.20 U13.19 U13.18 115.85,24.23
$1N2929: length 122.9
  Bottom Layer w0.254: U13.6 163.29,4.45 108.5,4.45 108.5,30.89 107.06,32.32 98.92,32.32 92.34,38.9 92.34,41.96 91.83,42.47 90.1,42.47 90.1,47.58 U1.2
$1N2939: length 110.5
  Bottom Layer w0.254: U13.2 159.97,32.09 159.97,56.78 96.76,56.78 U1.1
$1N4322: length 35
  Top Layer w0.254: 85.19,32.04 84.12,30.97 84.12,5.78 86.93,2.97 U1.20
$1N4327: length 111.6
  Top Layer w0.254: U13.7 171.46,7.9 171.46,5.59 170.25,4.38 92.34,4.38 U1.19 88.39,8.33 88.39,26.3 85.19,29.5
$1N4839: length 56.3
  Top Layer w0.254: U1.27 105.33,19.33 90.62,19.33 89.54,20.42 89.54,29.65 86.05,33.13 63.78,33.13 62.33,34.58
$1N4844: length 54.3
  Top Layer w0.254: 62.33,37.12 63.78,35.67 88.29,35.67 90.1,33.85 90.1,32.55 90.62,32.03 99.7,32.03 105.34,26.39 105.34,21.85 U1.28
$1N2495: length 17.2
  Bottom Layer w0.254: BAT3.2 39.33,2.33 BAT4.1

# Board PCB2
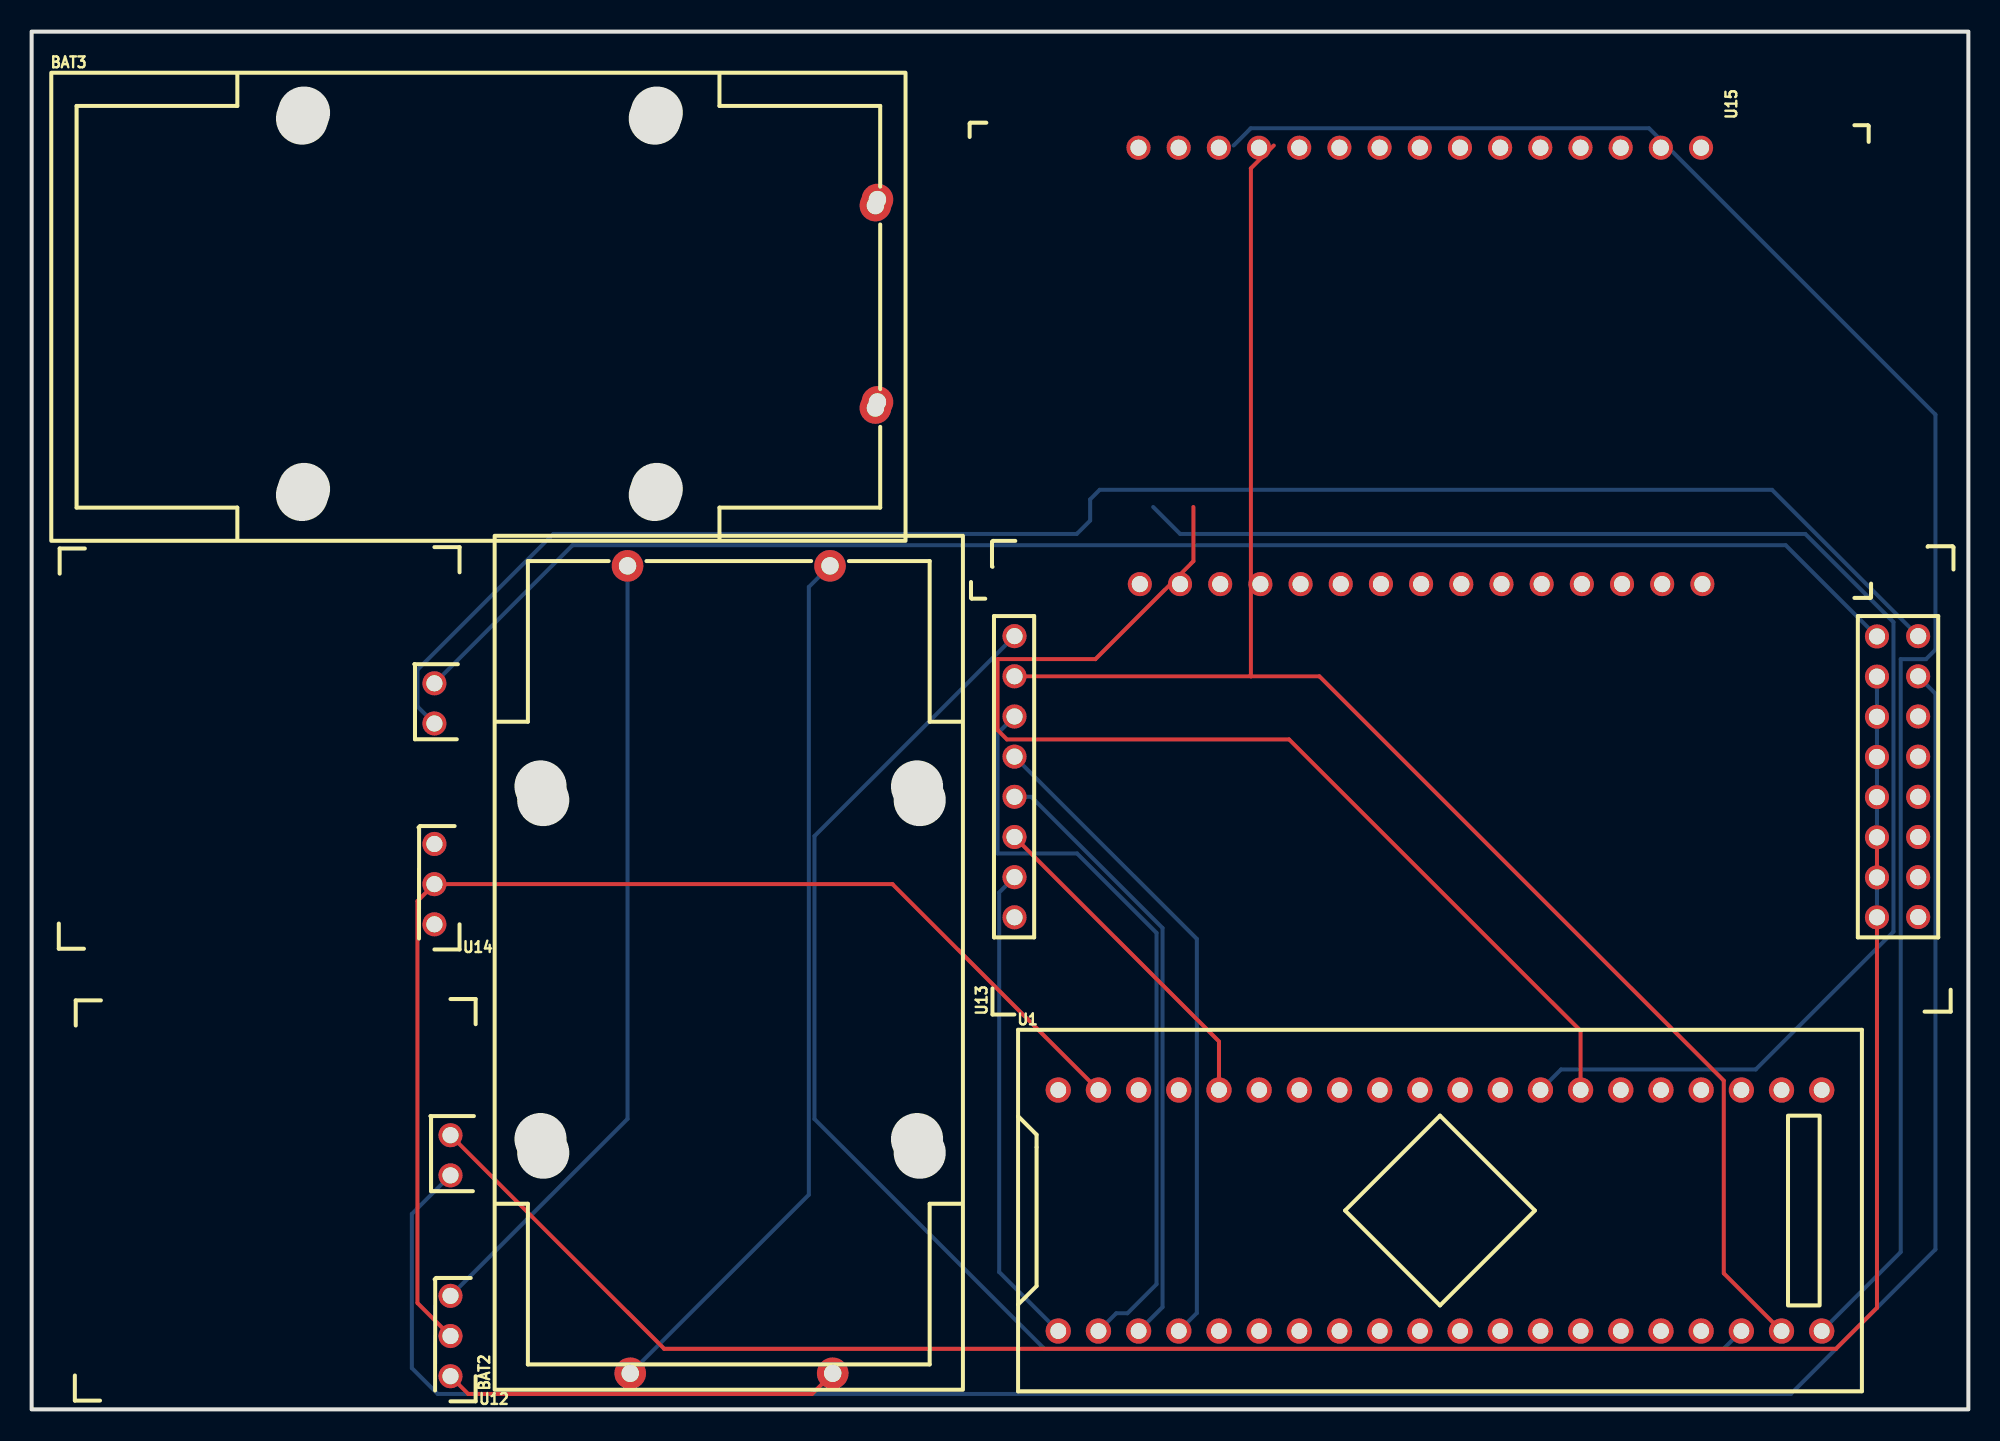
[diagram p6: board, top side]
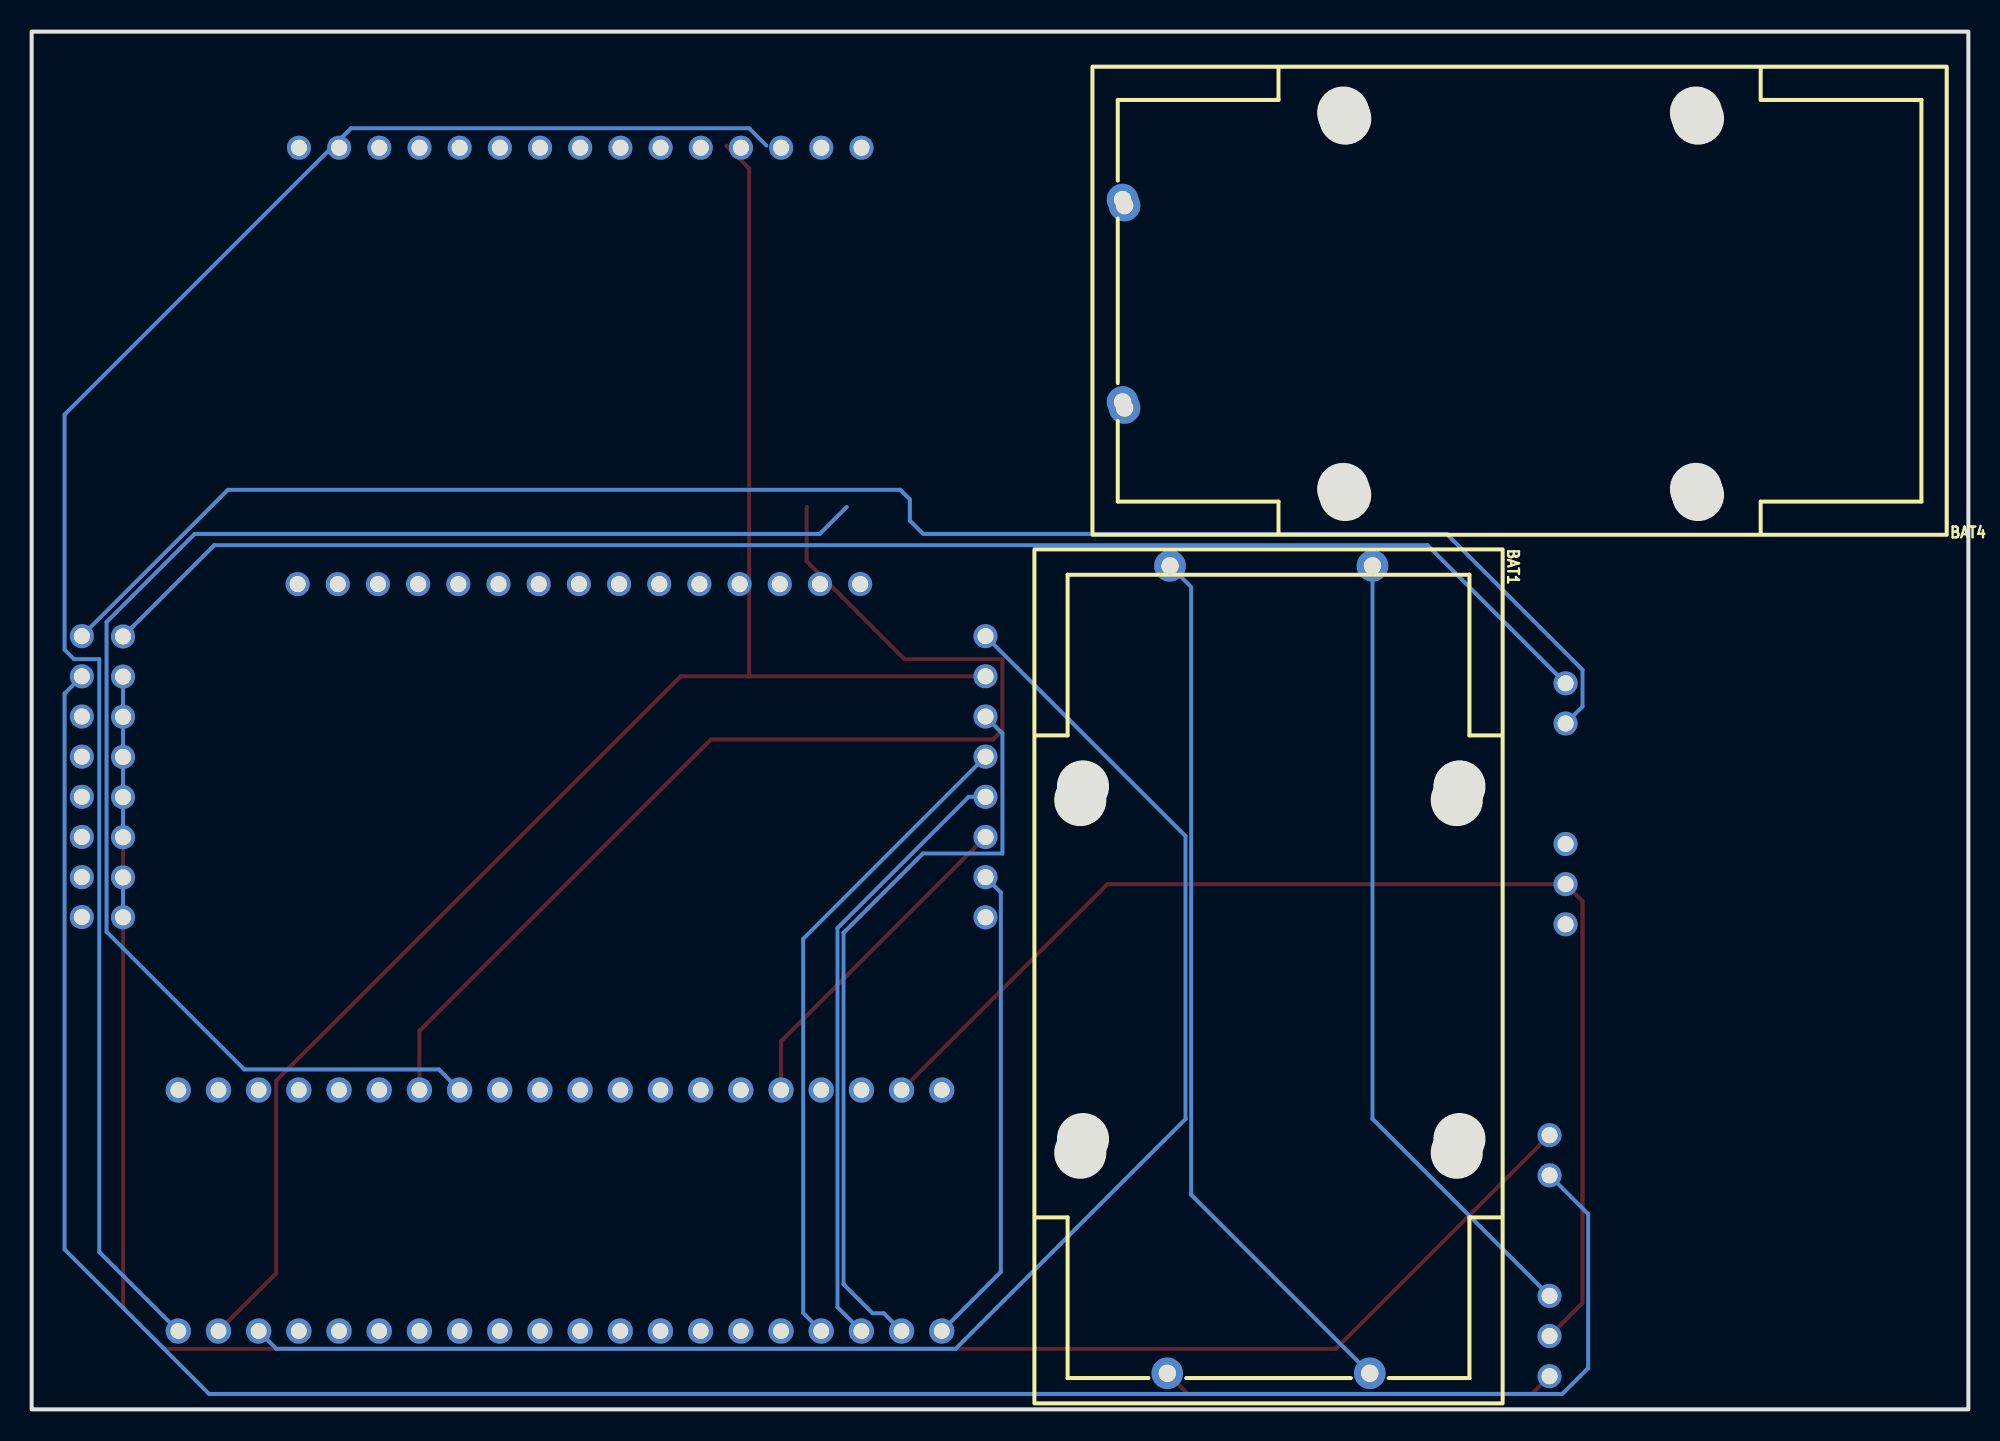
[diagram p7: board, bottom side, seen from below]

Outline 122.43 x 87.12 mm; copper layers: Top Layer, Bottom Layer. Coordinates in mm from the lower left corner of the outline.
Outline path: rectangle 0,87.12 122.43,0
Stack: Top Layer 0.035mm / Dielectric1 1.51mm FR4 er 4.5 / Bottom Layer 0.035mm

## Design rules (mm)
template: JLCPCB Capability(Two Layers Board)
spacing copperThickness1oz (default): track to track 0.102, other pairs 0.152 to 0.3
spacing copperThickness2oz: track to track 0.203, other pairs 0.152 to 0.3
track width copperThickness1oz (default): min 0.127, default 0.254, max 2.54
track width copperThickness2oz: min 0.203, default 0.254, max 2.54
differential pair differentialPair (default): width min 0.127, default 0.254, max 2.54; gap min 0.152, default 0.152
via viaSize (default): diameter min 0.5, default 0.61, max 10; hole min 0.3, default 0.305, max 6.3

## Placement (name value [footprint] x y rotation side)
BAT1  9V电池盒(BH-1294)  [BAT-TH_BH-1294]  44.24 2.28 270 bottom
BAT2  9V电池盒(BH-1294)  [BAT-TH_BH-1294]  44.07 53.34 90 top
BAT3  9V电池盒(BH-1294)  [BAT-TH_BH-1294]  53.34 69.72 0 top
BAT4  9V电池盒(BH-1294)  [BAT-TH_BH-1294]  53.47 70.1 0 bottom
U1  STM32F103C8T6  [CONN-TH_L53.3-W22.9_STM32F103C8T6-CARD]  89.03 12.57 0 top
U12  -  [AD8226]  28.07 0.51 180 top
U13  -  [ADS1256]  68.45 31.11 90 top
U14  -  [AD8226]  27.05 29.08 180 top
U15  -  [ESP8266]  59.31 81.41 270 top

## Footprints (pads in the part's own frame, mm; a bottom-side part is the same pattern mirrored in y, then rotated)
AD8226
  round 1.524 hole 1.02: 1(1.59,-1.59) 2(1.59,-4.13) 3(1.59,-6.67) 4(1.59,-14.29) 5(1.59,-16.83)
ADS1256
  round 1.524 hole 1.02: 1(0,6.322) 2(2.54,6.322) 3(5.08,6.322) 4(7.62,6.322) 5(10.16,6.322) 6(12.7,6.322) 7(15.24,6.322) 8(17.78,6.322) 9(17.78,-50.8) 10(15.24,-50.8) 11(12.7,-50.8) 12(10.16,-50.8) 13(7.62,-50.8) 14(5.08,-50.8) 15(2.54,-50.8) 16(0.019,-50.801) 17(0,-48.198) 18(2.521,-48.197) 19(5.061,-48.197) 20(7.601,-48.197) 21(10.141,-48.197) 22(12.681,-48.197) 23(15.221,-48.197) 24(17.761,-48.197)
BAT-TH_BH-1294
  round 2 hole 1.1: 1(0,-6.4) 2(0,6.4)
CONN-TH_L53.3-W22.9_STM32F103C8T6-CARD
  round 1.6 hole 1: 1(-24.13,-7.62) 2(-21.59,-7.62) 3(-19.05,-7.62) 4(-16.51,-7.62) 5(-13.97,-7.62) 6(-11.43,-7.62) 7(-8.89,-7.62) 8(-6.35,-7.62) 9(-3.81,-7.62) 10(-1.27,-7.62) 11(1.27,-7.62) 12(3.81,-7.62) 13(6.35,-7.62) 14(8.89,-7.62) 15(11.43,-7.62) 16(13.97,-7.62) 17(16.51,-7.62) 18(19.05,-7.62) 19(21.59,-7.62) 20(24.13,-7.62) 21(24.13,7.62) 22(21.59,7.62) 23(19.05,7.62) 24(16.51,7.62) 25(13.97,7.62) 26(11.43,7.62) 27(8.89,7.62) 28(6.35,7.62) 29(3.81,7.62) 30(1.27,7.62) 31(-1.27,7.62) 32(-3.81,7.62) 33(-6.35,7.62) 34(-8.89,7.62) 35(-11.43,7.62) 36(-13.97,7.62) 37(-16.51,7.62) 38(-19.05,7.62) 39(-21.59,7.62) 40(-24.13,7.62)
ESP8266
  round 1.524 hole 1.02: 1(1.627,46.221) 2(1.627,43.681) 3(1.627,41.141) 4(1.627,38.6) 5(1.627,36.06) 6(1.627,33.52) 7(1.627,30.98) 8(1.627,28.441) 9(1.627,25.901) 10(1.627,23.36) 11(1.627,20.82) 12(1.627,18.28) 13(1.627,15.741) 14(1.627,13.2) 15(1.627,10.661) 16(29.221,46.306) 17(29.221,43.766) 18(29.221,41.225) 19(29.221,38.685) 20(29.221,36.145) 21(29.221,33.605) 22(29.221,31.066) 23(29.221,28.526) 24(29.221,25.985) 25(29.221,23.445) 26(29.221,20.905) 27(29.221,18.366) 28(29.221,15.825) 29(29.221,13.286) 30(29.221,10.745)

## Nets
$1N615: BAT1.2 BAT2.1
$1N616: U1.18 U13.8
$1N617: U1.4 U13.5
$1N618: U1.3 U13.4
$1N619: U1.36 U13.3
$1N620: BAT3.2 BAT4.1
$1N621: BAT3.1 U14.1
$1N622: BAT4.2 U14.3
$1N623: U1.39 U12.2 U14.2
$1N624: U13.9 U14.4
$1N625: U13.24 U14.5
$1N626: BAT1.1 U12.1
$1N627: U1.2 U13.6
$1N628: U1.1 U13.2
$1N629: U1.20 U15.11
$1N630: U1.19 U13.7 U15.10
$1N631: U1.27 U15.27
$1N632: U1.28 U15.28
$1N633: BAT2.2 U12.3
$1N634: U12.4 U13.10
$1N635: U12.5 U13.17 U13.18 U13.19 U13.20 U13.21 U13.22 U13.23

Pads without a net: U1 5 6 7 8 9 10 11 12 13 14 15 16 17 21 22 23 24 25 26 29 30 31 32 33 34 35 37 38 40; U13 1 11 12 13 14 15 16; U15 1 2 3 4 5 6 7 8 9 12 13 14 15 16 17 18 19 20 21 22 23 24 25 26 29 30

## Routing (per net, layer and track width the routed paths; a pad name or vN(x,y) marks a point on that pad's centre or on a via; arc(x,y) is an arc through that point)
$1N615: length 56.3
  Bottom Layer w0.254: BAT1.2 49.13,13.57 49.13,52 BAT2.1
$1N616: length 100.8
  Bottom Layer w0.254: U1.18 106.95,3.83 64.02,3.83 49.49,18.36 49.49,36.25 U13.8
$1N617: length 41.6
  Bottom Layer w0.254: U1.4 73.66,6.09 73.66,29.75 U13.5
$1N618: length 38.9
  Bottom Layer w0.254: 69.98,4.95 71.49,6.46 71.49,30.44 63.19,38.73 U13.4
$1N619: length 21.4
  Top Layer w0.254: U13.3 75.06,23.27 75.06,20.19
$1N620: length 0.4
  Bottom Layer w0.254: BAT3.2 53.34,76.38 BAT4.1
$1N623: length 77.3
  Top Layer w0.254: 67.44,20.19 54.42,33.21 U14.2 24.39,32.14 24.39,6.72 26.48,4.64
$1N624: length 108
  Bottom Layer w0.254: U13.9 119.25,48.91 110.02,58.15 67.52,58.15 66.91,57.54 66.91,56.2 66.07,55.36 32.98,55.36 24.39,46.77 24.39,44.44 U14.4
$1N625: length 97.2
  Bottom Layer w0.254: U14.5 34.19,54.65 110.88,54.65 U13.24
$1N626: length 25.2
  Top Layer w0.254: BAT1.1 49.33,0.97 27.6,0.97 26.48,2.1
$1N627: length 48.3
  Bottom Layer w0.254: U1.2 68.56,6.08 69.27,6.08 71.11,7.91 71.11,30.13 66.08,35.15 61.06,35.15 61.06,42.74 U13.6
$1N628: length 30.6
  Bottom Layer w0.254: U13.2 61.16,32.69 61.16,8.69 U1.1
$1N629: length 114.2
  Bottom Layer w0.254: 75.98,79.92 77.07,81.01 102.24,81.01 120.35,62.91 120.35,48.04 119.75,47.44 118.15,47.44 118.15,9.95 113.16,4.95
$1N630: length 106.9
  Top Layer w0.254: 78.52,79.92 77.07,78.47 77.07,46.35 ; 77.07,46.35 81.4,46.35 106.97,20.79 106.97,8.6 U1.19 ; 77.07,46.35 U13.7
$1N631: length 71.3
  Top Layer w0.254: 97.92,20.19 97.92,23.93 79.49,42.36 61.65,42.36 61.06,42.96 61.06,47.44 67.25,47.44 73.44,53.63 73.44,57.06
$1N632: length 95.9
  Bottom Layer w0.254: 95.38,20.19 96.68,21.5 108.98,21.5 117.69,30.21 117.69,49.78 112.12,55.36 72.6,55.36 70.9,57.06
$1N633: length 50.8
  Bottom Layer w0.254: 26.48,7.18 37.67,18.37 37.67,53.34
$1N634: length 150.7
  Bottom Layer w0.254: 26.48,14.8 24.03,12.35 24.03,2.61 25.67,0.97 111.21,0.97 120.35,10.12 120.35,45.26 U13.10
$1N635: length 136.8
  Top Layer w0.254: U13.17 116.65,6.42 114.06,3.83 39.99,3.83 26.48,17.34 ; U13.19 U13.18
  Bottom Layer w0.254: U13.18 U13.17 ; U13.23 U13.22 U13.21 U13.20 U13.19

# Board PCB3
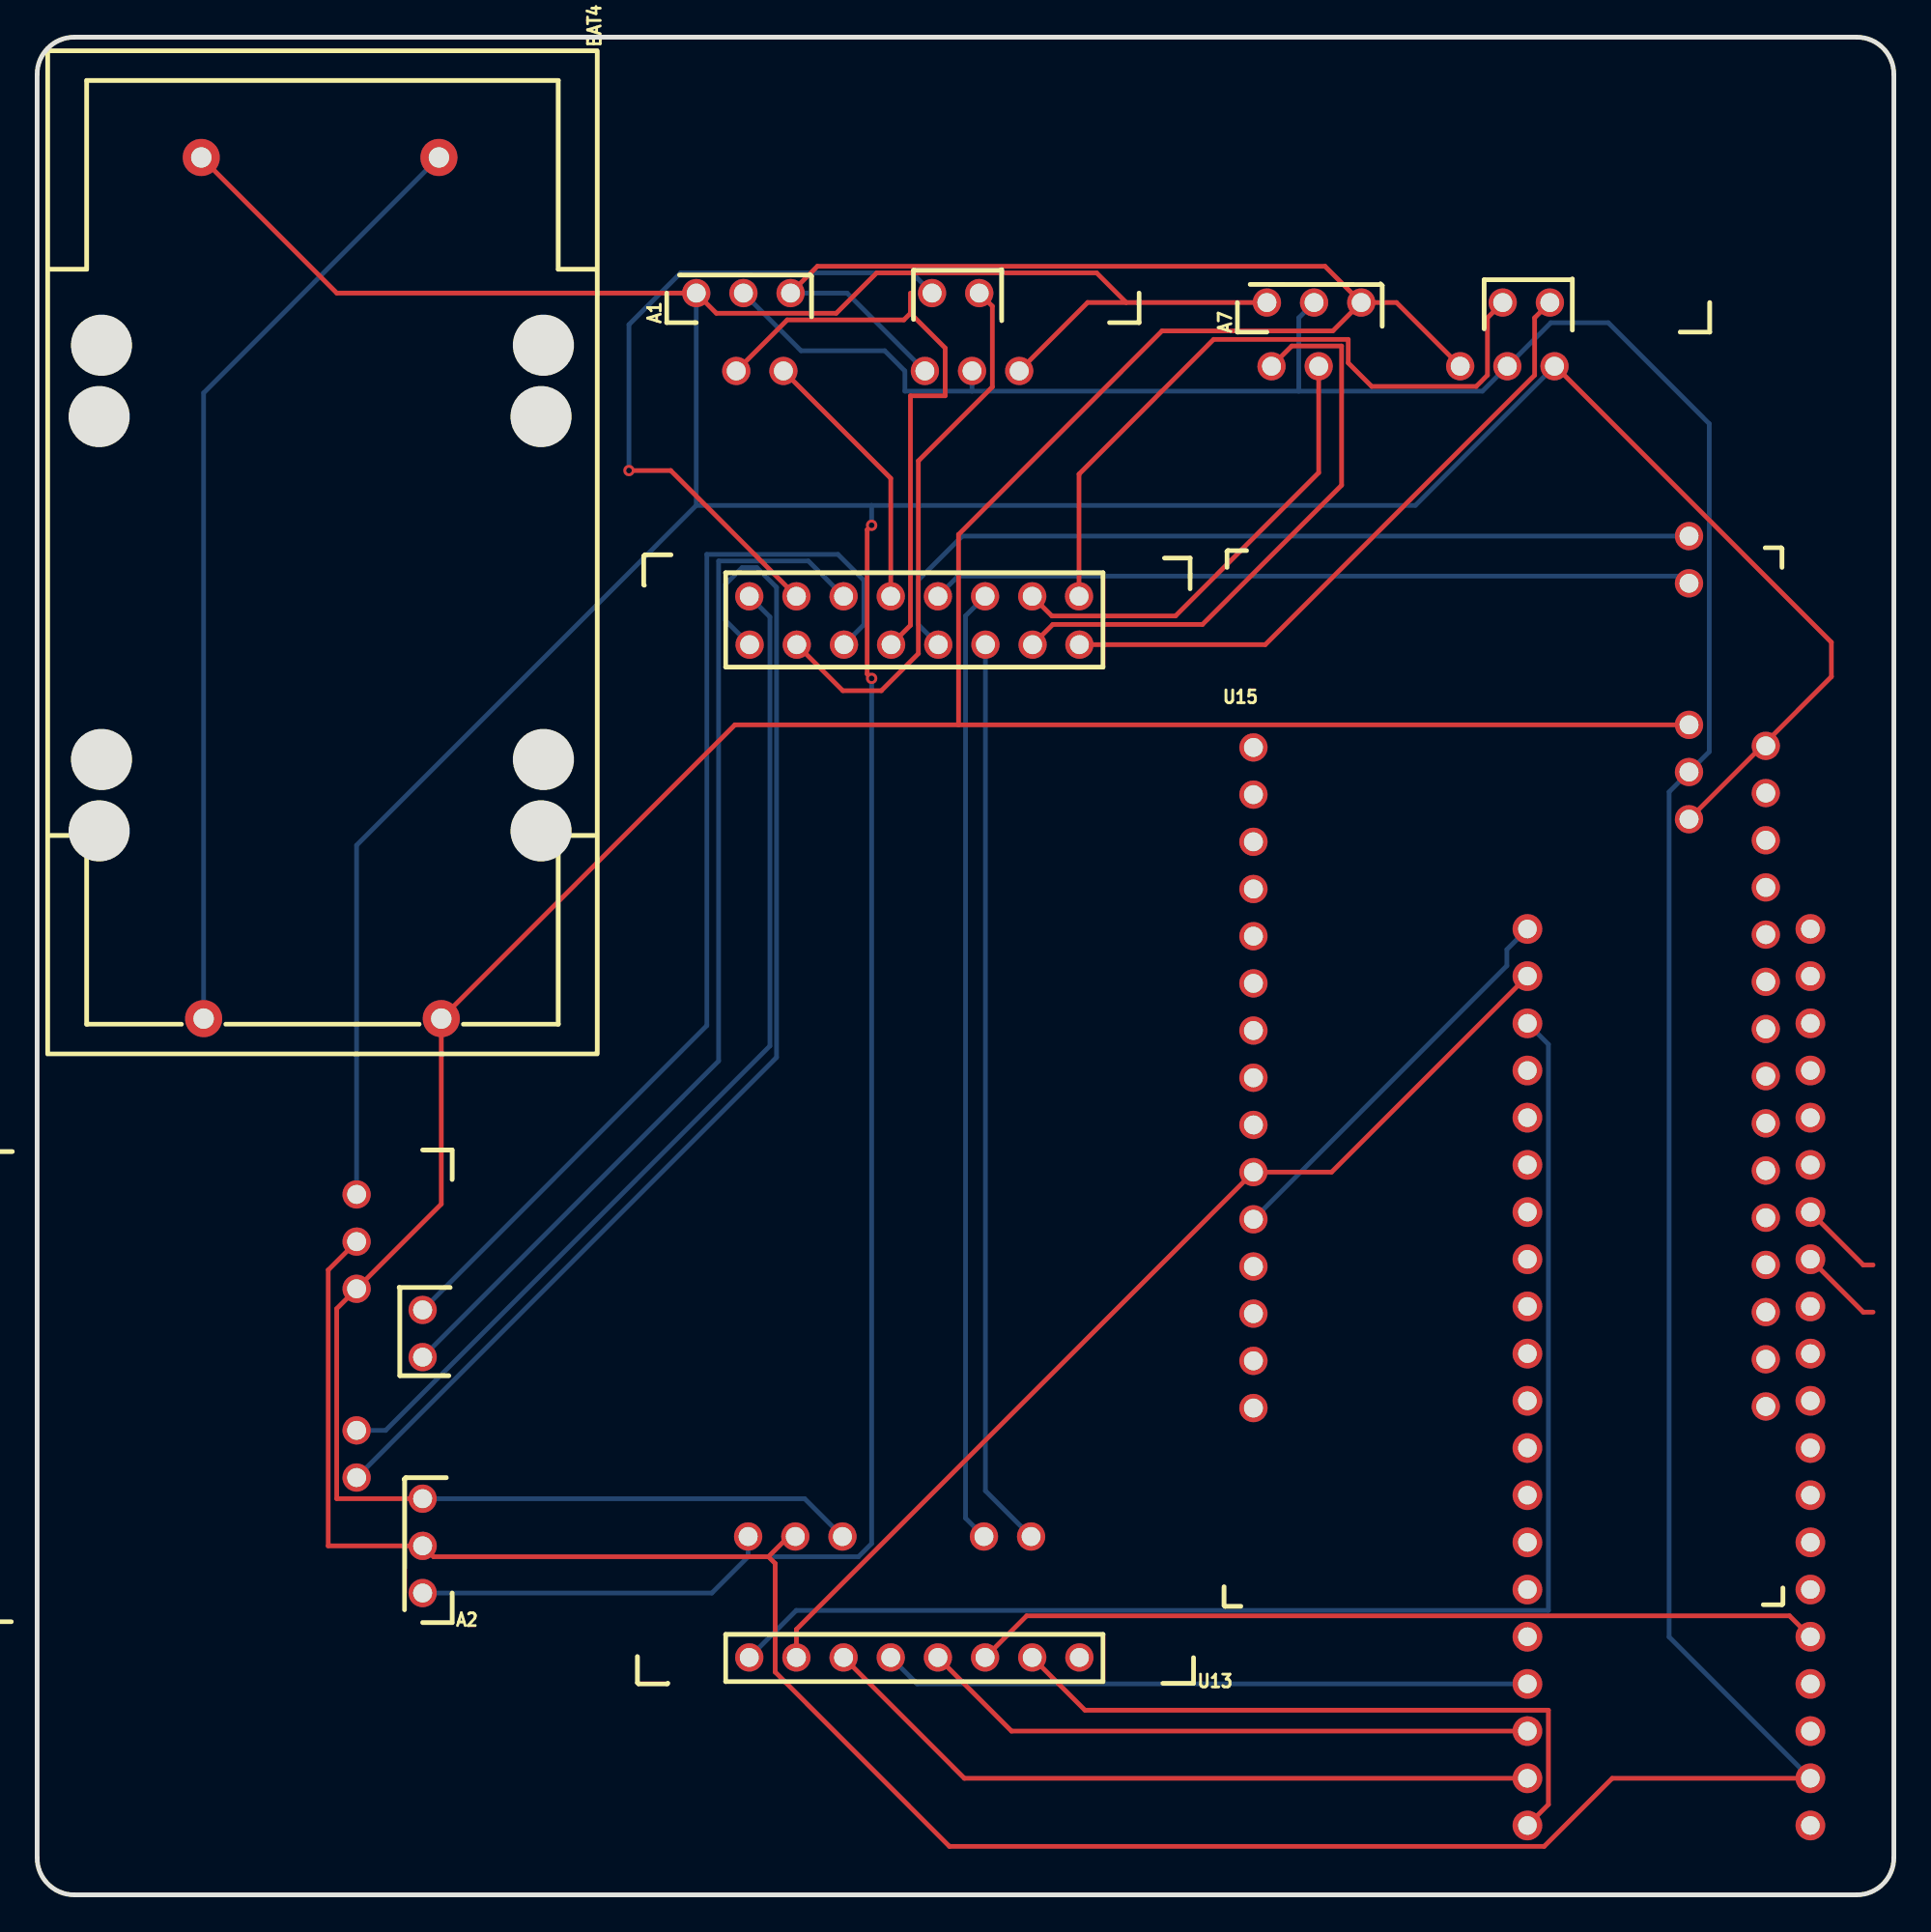
[diagram p8: board, top side]
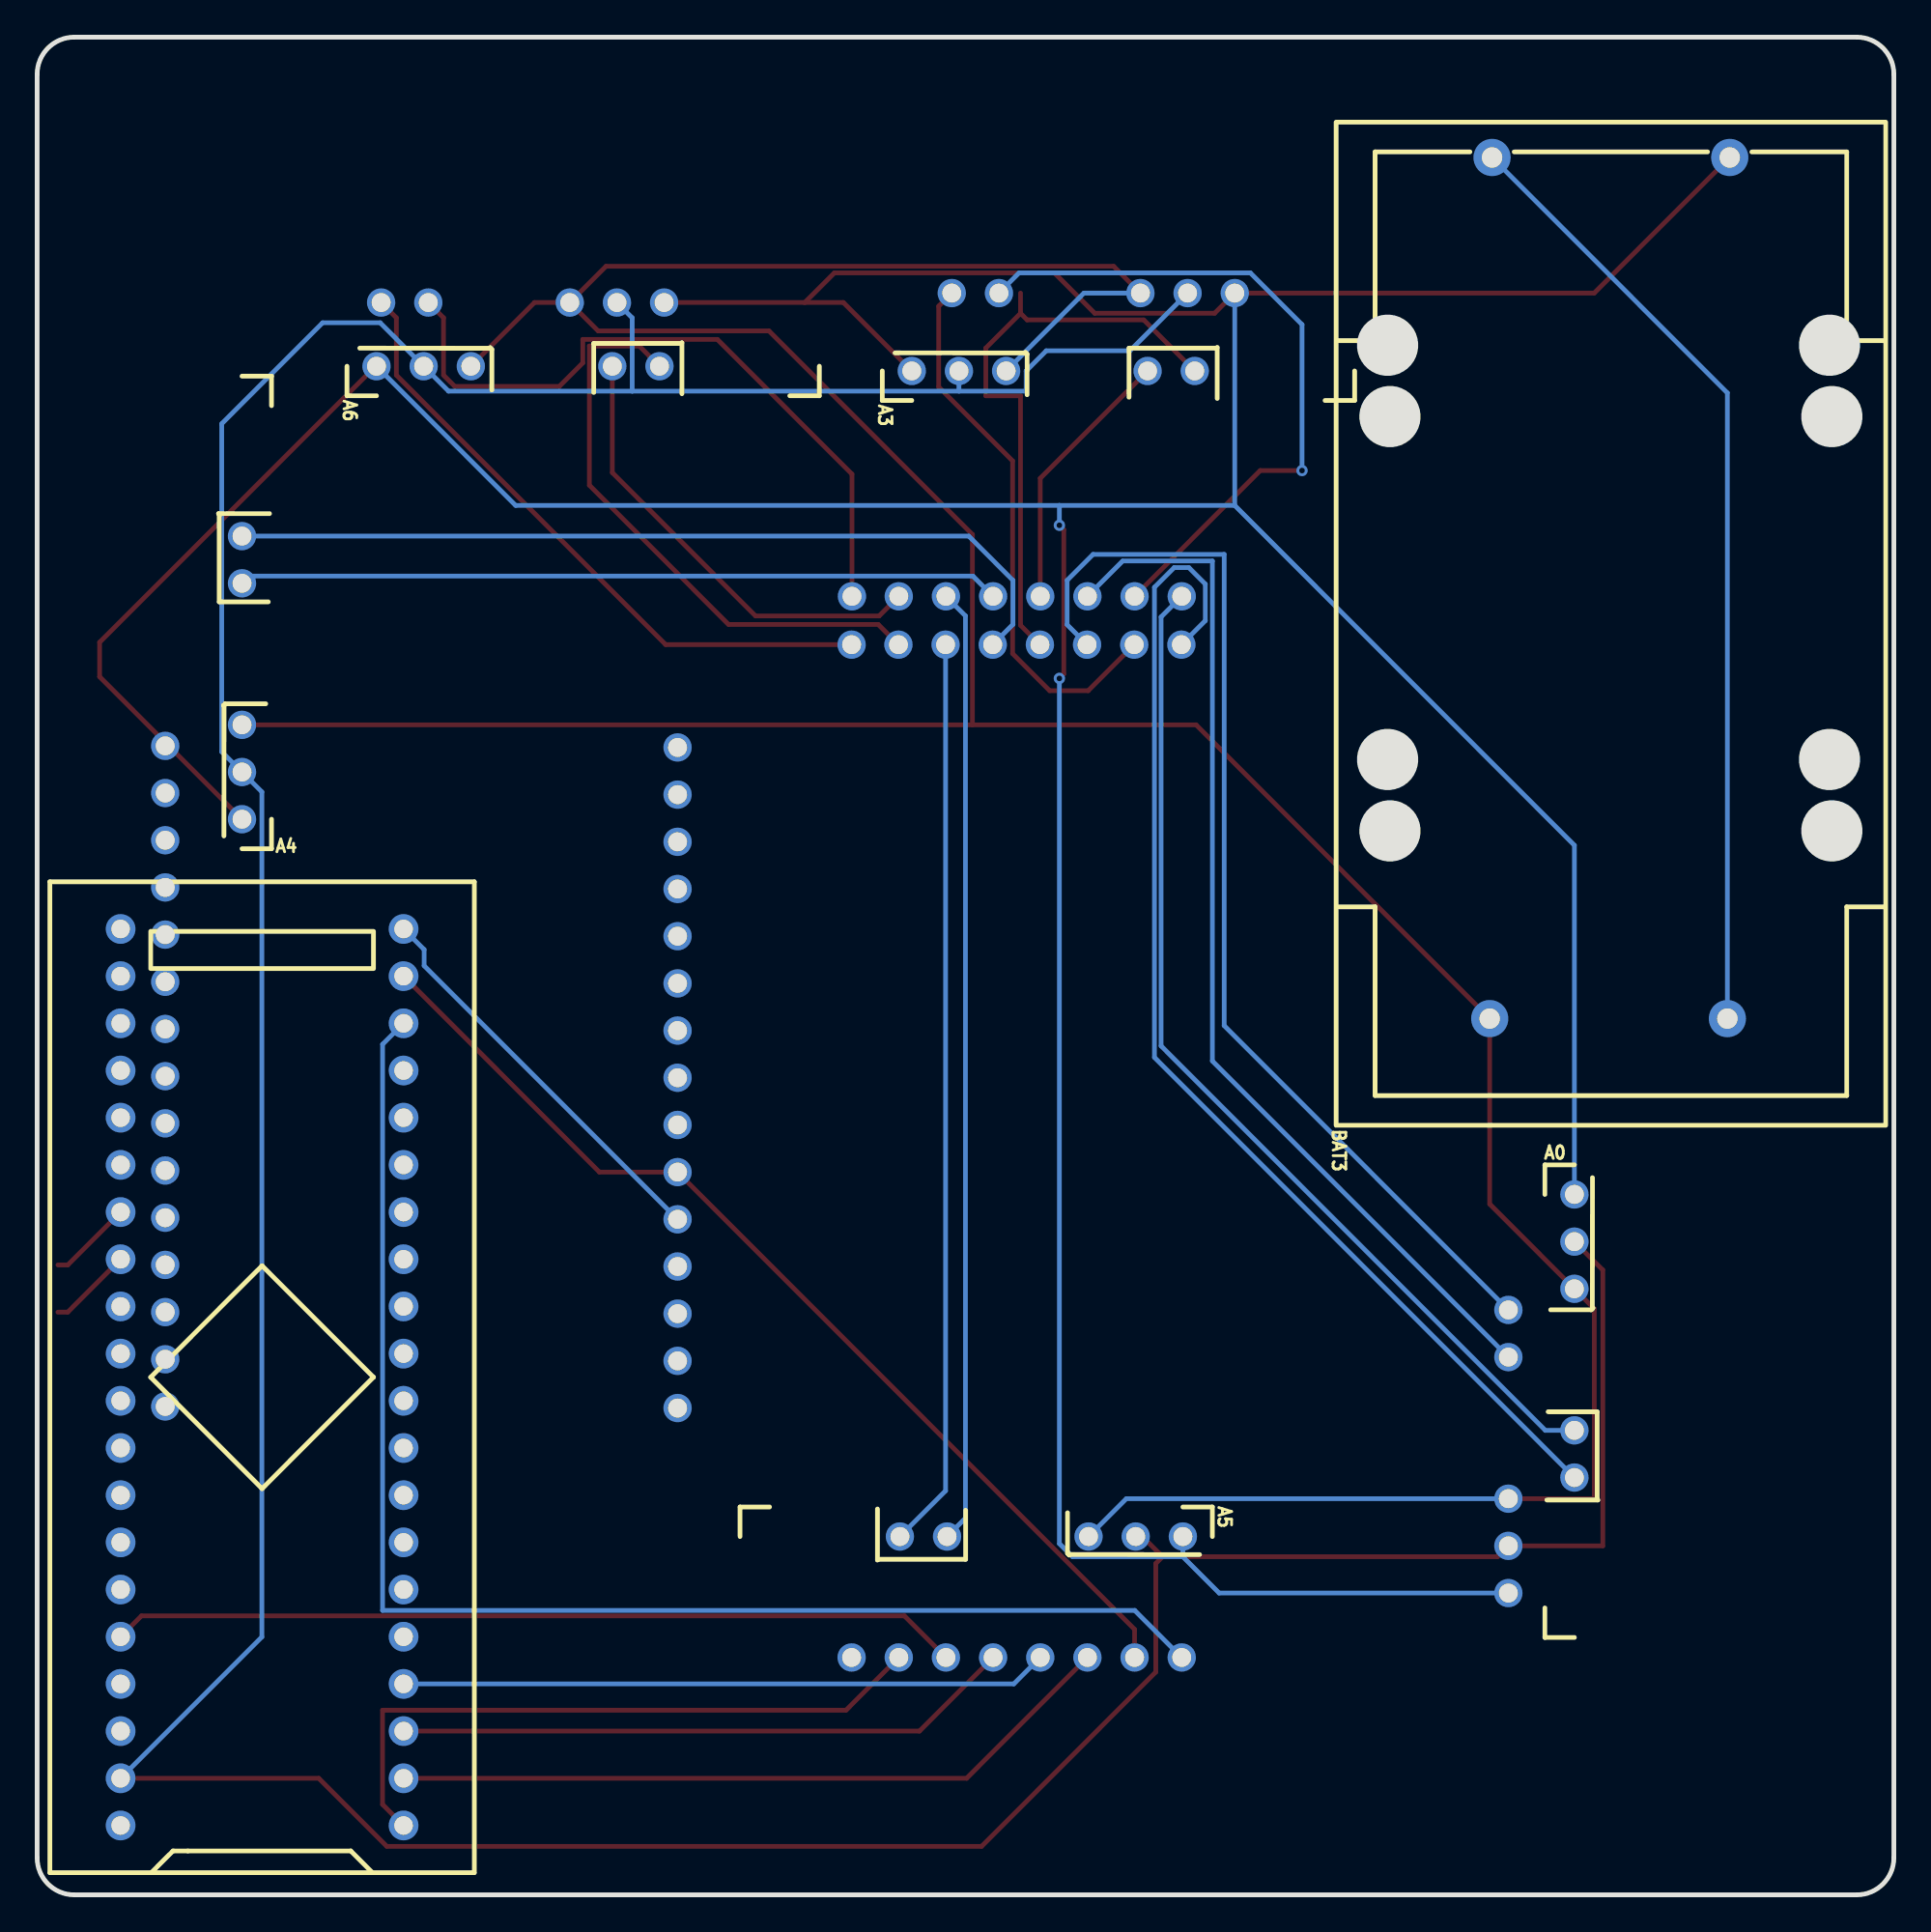
[diagram p9: board, bottom side, seen from below]

Outline 100 x 100 mm; copper layers: Top Layer, Bottom Layer. Coordinates in mm from the lower left corner of the outline.
Outline path: 0,98 0,2 arc(0.59,0.59) 2,0 98,0 arc(99.41,0.59) 100,2 100,98 arc(99.41,99.41) 98,100 2,100 arc(0.59,99.41) 0,98
Stack: Top Layer 0.035mm / Dielectric1 1.51mm FR4 er 4.5 / Bottom Layer 0.035mm

## Design rules (mm)
template: JLCPCB Capability(Two Layers Board)
spacing copperThickness1oz (default): track to track 0.102, other pairs 0.152 to 0.3
spacing copperThickness2oz: track to track 0.203, other pairs 0.152 to 0.3
track width copperThickness1oz (default): min 0.127, default 0.254, max 2.54
track width copperThickness2oz: min 0.203, default 0.254, max 2.54
differential pair differentialPair (default): width min 0.127, default 0.254, max 2.54; gap min 0.152, default 0.152
via viaSize (default): diameter min 0.5, default 0.61, max 10; hole min 0.3, default 0.305, max 6.3

## Placement (name value [footprint] x y rotation side)
A0  -  [AD8226]  18.8 39.29 180 bottom
A1  -  [AD8226]  33.91 84.63 90 top
A2  -  [AD8226]  22.35 14.66 180 top
A3  -  [AD8226]  54.48 80.44 90 bottom
A4  -  [AD8226]  87.38 56.31 0 bottom
A5  -  [AD8226]  36.7 20.88 270 bottom
A6  -  [AD8226]  83.31 80.7 90 bottom
A7  -  [AD8226]  64.64 84.12 90 top
BAT3  9V电池盒(BH-1294)  [BAT-TH_BH-1294]  15.24 93.52 90 bottom
BAT4  9V电池盒(BH-1294)  [BAT-TH_BH-1294]  15.37 47.17 270 top
U1  STM32F103C8T6  [CONN-TH_L53.3-W22.9_STM32F103C8T6-CARD]  87.88 27.86 90 bottom
U13  -  [ADS1256]  56.13 19.1 180 top
U15  -  [ESP8266]  63.88 15.54 0 top

## Footprints (pads in the part's own frame, mm; a bottom-side part is the same pattern mirrored in y, then rotated)
AD8226
  round 1.524 hole 1.02: 1(1.59,-1.59) 2(1.59,-4.13) 3(1.59,-6.67) 4(1.59,-14.29) 5(1.59,-16.83)
ADS1256
  round 1.524 hole 1.02: 1(0,6.322) 2(2.54,6.322) 3(5.08,6.322) 4(7.62,6.322) 5(10.16,6.322) 6(12.7,6.322) 7(15.24,6.322) 8(17.78,6.322) 9(17.78,-50.8) 10(15.24,-50.8) 11(12.7,-50.8) 12(10.16,-50.8) 13(7.62,-50.8) 14(5.08,-50.8) 15(2.54,-50.8) 16(0.019,-50.801) 17(0,-48.198) 18(2.521,-48.197) 19(5.061,-48.197) 20(7.601,-48.197) 21(10.141,-48.197) 22(12.681,-48.197) 23(15.221,-48.197) 24(17.761,-48.197)
BAT-TH_BH-1294
  round 2 hole 1.1: 1(0,-6.4) 2(0,6.4)
CONN-TH_L53.3-W22.9_STM32F103C8T6-CARD
  round 1.6 hole 1: 1(-24.13,-7.62) 2(-21.59,-7.62) 3(-19.05,-7.62) 4(-16.51,-7.62) 5(-13.97,-7.62) 6(-11.43,-7.62) 7(-8.89,-7.62) 8(-6.35,-7.62) 9(-3.81,-7.62) 10(-1.27,-7.62) 11(1.27,-7.62) 12(3.81,-7.62) 13(6.35,-7.62) 14(8.89,-7.62) 15(11.43,-7.62) 16(13.97,-7.62) 17(16.51,-7.62) 18(19.05,-7.62) 19(21.59,-7.62) 20(24.13,-7.62) 21(24.13,7.62) 22(21.59,7.62) 23(19.05,7.62) 24(16.51,7.62) 25(13.97,7.62) 26(11.43,7.62) 27(8.89,7.62) 28(6.35,7.62) 29(3.81,7.62) 30(1.27,7.62) 31(-1.27,7.62) 32(-3.81,7.62) 33(-6.35,7.62) 34(-8.89,7.62) 35(-11.43,7.62) 36(-13.97,7.62) 37(-16.51,7.62) 38(-19.05,7.62) 39(-21.59,7.62) 40(-24.13,7.62)
ESP8266
  round 1.524 hole 1.02: 1(1.627,46.221) 2(1.627,43.681) 3(1.627,41.141) 4(1.627,38.6) 5(1.627,36.06) 6(1.627,33.52) 7(1.627,30.98) 8(1.627,28.441) 9(1.627,25.901) 10(1.627,23.36) 11(1.627,20.82) 12(1.627,18.28) 13(1.627,15.741) 14(1.627,13.2) 15(1.627,10.661) 16(29.221,46.306) 17(29.221,43.766) 18(29.221,41.225) 19(29.221,38.685) 20(29.221,36.145) 21(29.221,33.605) 22(29.221,31.066) 23(29.221,28.526) 24(29.221,25.985) 25(29.221,23.445) 26(29.221,20.905) 27(29.221,18.366) 28(29.221,15.825) 29(29.221,13.286) 30(29.221,10.745)

## Nets
$1N616: U1.18 U13.8
$1N617: U1.4 U13.5
$1N618: U1.3 U13.4
$1N619: U1.36 U13.3
$1N620: BAT3.2 BAT4.1
$1N624: A0.4 U13.9
$1N625: A0.5 U13.24
$1N627: U1.2 U13.6
$1N628: U1.1 U13.2
$1N629: U1.20 U15.11
$1N630: U1.19 U13.7 U15.10
$1N631: U1.27 U15.27
$1N632: U1.28 U15.28
$1N634: A1.4 U13.10
$1N1306: A2.4 U13.11
$1N1388: A3.4 U13.12
$1N1463: A4.4 U13.13
$1N1647: A5.4 U13.14
$1N1730: A0.1 A1.1 A2.1 A3.1 A4.1 A5.1 A6.1 A7.1 BAT3.1
$1N1800: A0.3 A1.3 A2.3 A3.3 A4.3 A5.3 A6.3 A7.3 BAT4.2
$1N1867: A7.4 U13.16
$1N1954: A0.2 A1.2 A2.2 A3.2 A4.2 A5.2 A6.2 A7.2 U1.39
$1N2227: A7.5 U13.17
$1N2407: A1.5 U13.23
$1N2431: A2.5 U13.22
$1N2443: A3.5 U13.21
$1N2459: A4.5 U13.20
$1N2638: A5.5 U13.19
$1N2652: A6.4 U13.15
$1N2664: A6.5 U13.18

Pads without a net: U1 5 6 7 8 9 10 11 12 13 14 15 16 17 21 22 23 24 25 26 29 30 31 32 33 34 35 37 38 40; U13 1; U15 1 2 3 4 5 6 7 8 9 12 13 14 15 16 17 18 19 20 21 22 23 24 25 26 29 30

## Via types
v1: diameter 0.61, hole 0.305, Top Layer to Bottom Layer, 3 vias

## Routing (per net, layer and track width the routed paths; a pad name or vN(x,y) marks a point on that pad's centre or on a via; arc(x,y) is an arc through that point)
$1N616: length 76.2
  Bottom Layer w0.254: U1.18 81.39,45.78 81.39,15.31 40.88,15.31 U13.8
$1N617: length 34.9
  Bottom Layer w0.254: U13.5 47.4,11.35 U1.4
$1N618: length 33.4
  Top Layer w0.254: U13.4 52.48,8.81 U1.3
$1N619: length 45.8
  Top Layer w0.254: U1.36 94.38,15.02 53.29,15.02 U13.3
$1N620: length 51.6
  Bottom Layer w0.254: BAT4.1 8.97,80.85 BAT3.2
$1N624: length 55.5
  Bottom Layer w0.254: A0.4 18.77,25 39.47,45.7 39.47,68.79 U13.9
$1N625: length 64.6
  Bottom Layer w0.254: A0.5 39.82,45.08 39.82,70.38 38.76,71.45 37.97,71.45 37.08,70.56 37.08,68.59 U13.24
$1N627: length 39.5
  Top Layer w0.254: U1.2 49.94,6.27 U13.6
$1N628: length 35.7
  Top Layer w0.254: U13.2 56.43,9.94 81.39,9.94 81.39,4.87 U1.1
$1N629: length 21.7
  Bottom Layer w0.254: U1.20 79.16,50.89 79.16,50.01 U15.11
$1N630: length 55.4
  Top Layer w0.254: U13.7 40.89,14.29 U15.10 69.72,38.91 U1.19
$1N631: length 4.6
  Top Layer w0.254: U1.27 98.35,33.91 98.88,33.91
$1N632: length 4.6
  Top Layer w0.254: U1.28 98.35,31.37 98.88,31.37
$1N634: length 37.6
  Top Layer w0.254: v1(31.87,76.67) 34.12,76.67 U13.10
  Bottom Layer w0.254: A1.4 47.11,87.31 34.66,87.31 31.87,84.53 v1(31.87,76.67)
$1N1306: length 57
  Bottom Layer w0.254: U13.11 41.53,71.8 36.7,71.8 36.7,44.89 20.76,28.95
$1N1388: length 14.5
  Top Layer w0.254: U13.12 45.97,76.25 A3.4
$1N1463: length 41.1
  Bottom Layer w0.254: U13.13 49.6,70.99 88.58,70.99 A4.4
$1N1647: length 51.5
  Bottom Layer w0.254: A5.4 50,20.28 50,68.85 U13.14
$1N1730: length 291.4
  Top Layer w0.254: v1(44.94,73.72) 44.7,73.48 44.7,65.72 v1(44.94,65.48) ; BAT3.1 16.14,86.22 A1.1 36.59,85.14 43.04,85.14 45.21,87.31 57.06,87.31 58.66,85.72 ; 58.66,85.72 A7.1 ; 58.66,85.72 56.58,85.72 A3.1 ; A4.1 96.64,65.57 96.64,67.42 81.77,82.29 A6.1
  Bottom Layer w0.254: 38.29,18.2 A5.1 ; 38.29,18.2 44.24,18.2 44.94,18.91 v1(44.94,65.48) ; 38.29,18.2 36.34,16.25 20.76,16.25 ; 44.94,74.79 v1(44.94,73.72) ; 44.94,74.79 74.23,74.79 A6.1 ; 44.94,74.79 35.5,74.79 ; A0.1 17.21,56.5 35.5,74.79 ; 35.5,74.79 A1.1
$1N1800: length 215
  Top Layer w0.254: A6.3 73.21,85.72 A7.3 ; A7.3 69.79,84.19 60.59,84.19 49.63,73.23 49.63,62.98 ; A7.3 69.36,87.67 42.02,87.67 A1.3 ; 49.63,62.98 A4.3 ; 49.63,62.98 37.58,62.98 BAT4.2 21.77,37.19 A0.3 16.13,31.55 16.13,21.33 20.76,21.33
  Bottom Layer w0.254: A3.3 43.62,86.22 A1.3 ; A5.3 41.34,21.33 20.76,21.33
$1N1867: length 37.9
  Top Layer w0.254: U13.16 56.11,76.48 63.36,83.73 70.61,83.73 70.61,82.46 71.88,81.2 77.51,81.2 78.11,81.8 78.11,84.89 A7.4
$1N1954: length 252.2
  Top Layer w0.254: 39.39,18.2 40.47,19.29 A5.2 ; 39.39,18.2 39.75,17.84 39.75,11.99 49.14,2.61 81.17,2.61 84.83,6.27 U1.39 ; 39.39,18.2 21.35,18.2 20.76,18.79 15.68,18.79 15.68,33.64 A0.2
  Bottom Layer w0.254: 67.95,80.94 50.35,80.94 ; 67.95,80.94 77.84,80.94 A6.2 81.52,84.63 84.62,84.63 90.06,79.19 90.06,61.53 A4.2 87.89,59.37 87.89,13.88 U1.39 ; 67.95,80.94 67.95,84.89 A7.2 ; 50.35,80.94 46.73,80.94 46.73,82.03 45.65,83.12 41.14,83.12 A1.2 ; 50.35,80.94 A3.2
$1N2227: length 34.8
  Top Layer w0.254: A7.5 80.65,84.89 80.65,81.8 66.15,67.3 U13.17
$1N2407: length 29.8
  Top Layer w0.254: U13.23 43.39,64.82 45.47,64.82 47.46,66.82 47.46,77.19 51.45,81.17 51.45,85.52 A1.5
$1N2431: length 60
  Bottom Layer w0.254: U13.22 44.53,68.37 44.53,70.76 43.13,72.16 36.07,72.16 36.07,46.79 20.76,31.49
$1N2443: length 32.7
  Top Layer w0.254: 47.04,85.14 46.68,84.78 40.4,84.78 A3.5 ; 47.04,85.14 47.04,86.22 ; 47.04,85.14 48.91,83.27 48.91,80.7 47.04,80.7 47.04,68.34 U13.21
$1N2459: length 46.4
  Bottom Layer w0.254: A4.5 49.83,73.14 47.44,70.76 47.44,68.39 U13.20
$1N2638: length 49
  Bottom Layer w0.254: U13.19 51.07,21.75 A5.5
$1N2652: length 24.8
  Top Layer w0.254: A6.4 69.02,76.56 61.31,68.84 54.65,68.84 U13.15
$1N2664: length 31.9
  Top Layer w0.254: A6.5 67.57,83.37 70.26,83.37 70.26,75.88 62.76,68.39 54.7,68.39 U13.18

# Board PCB4
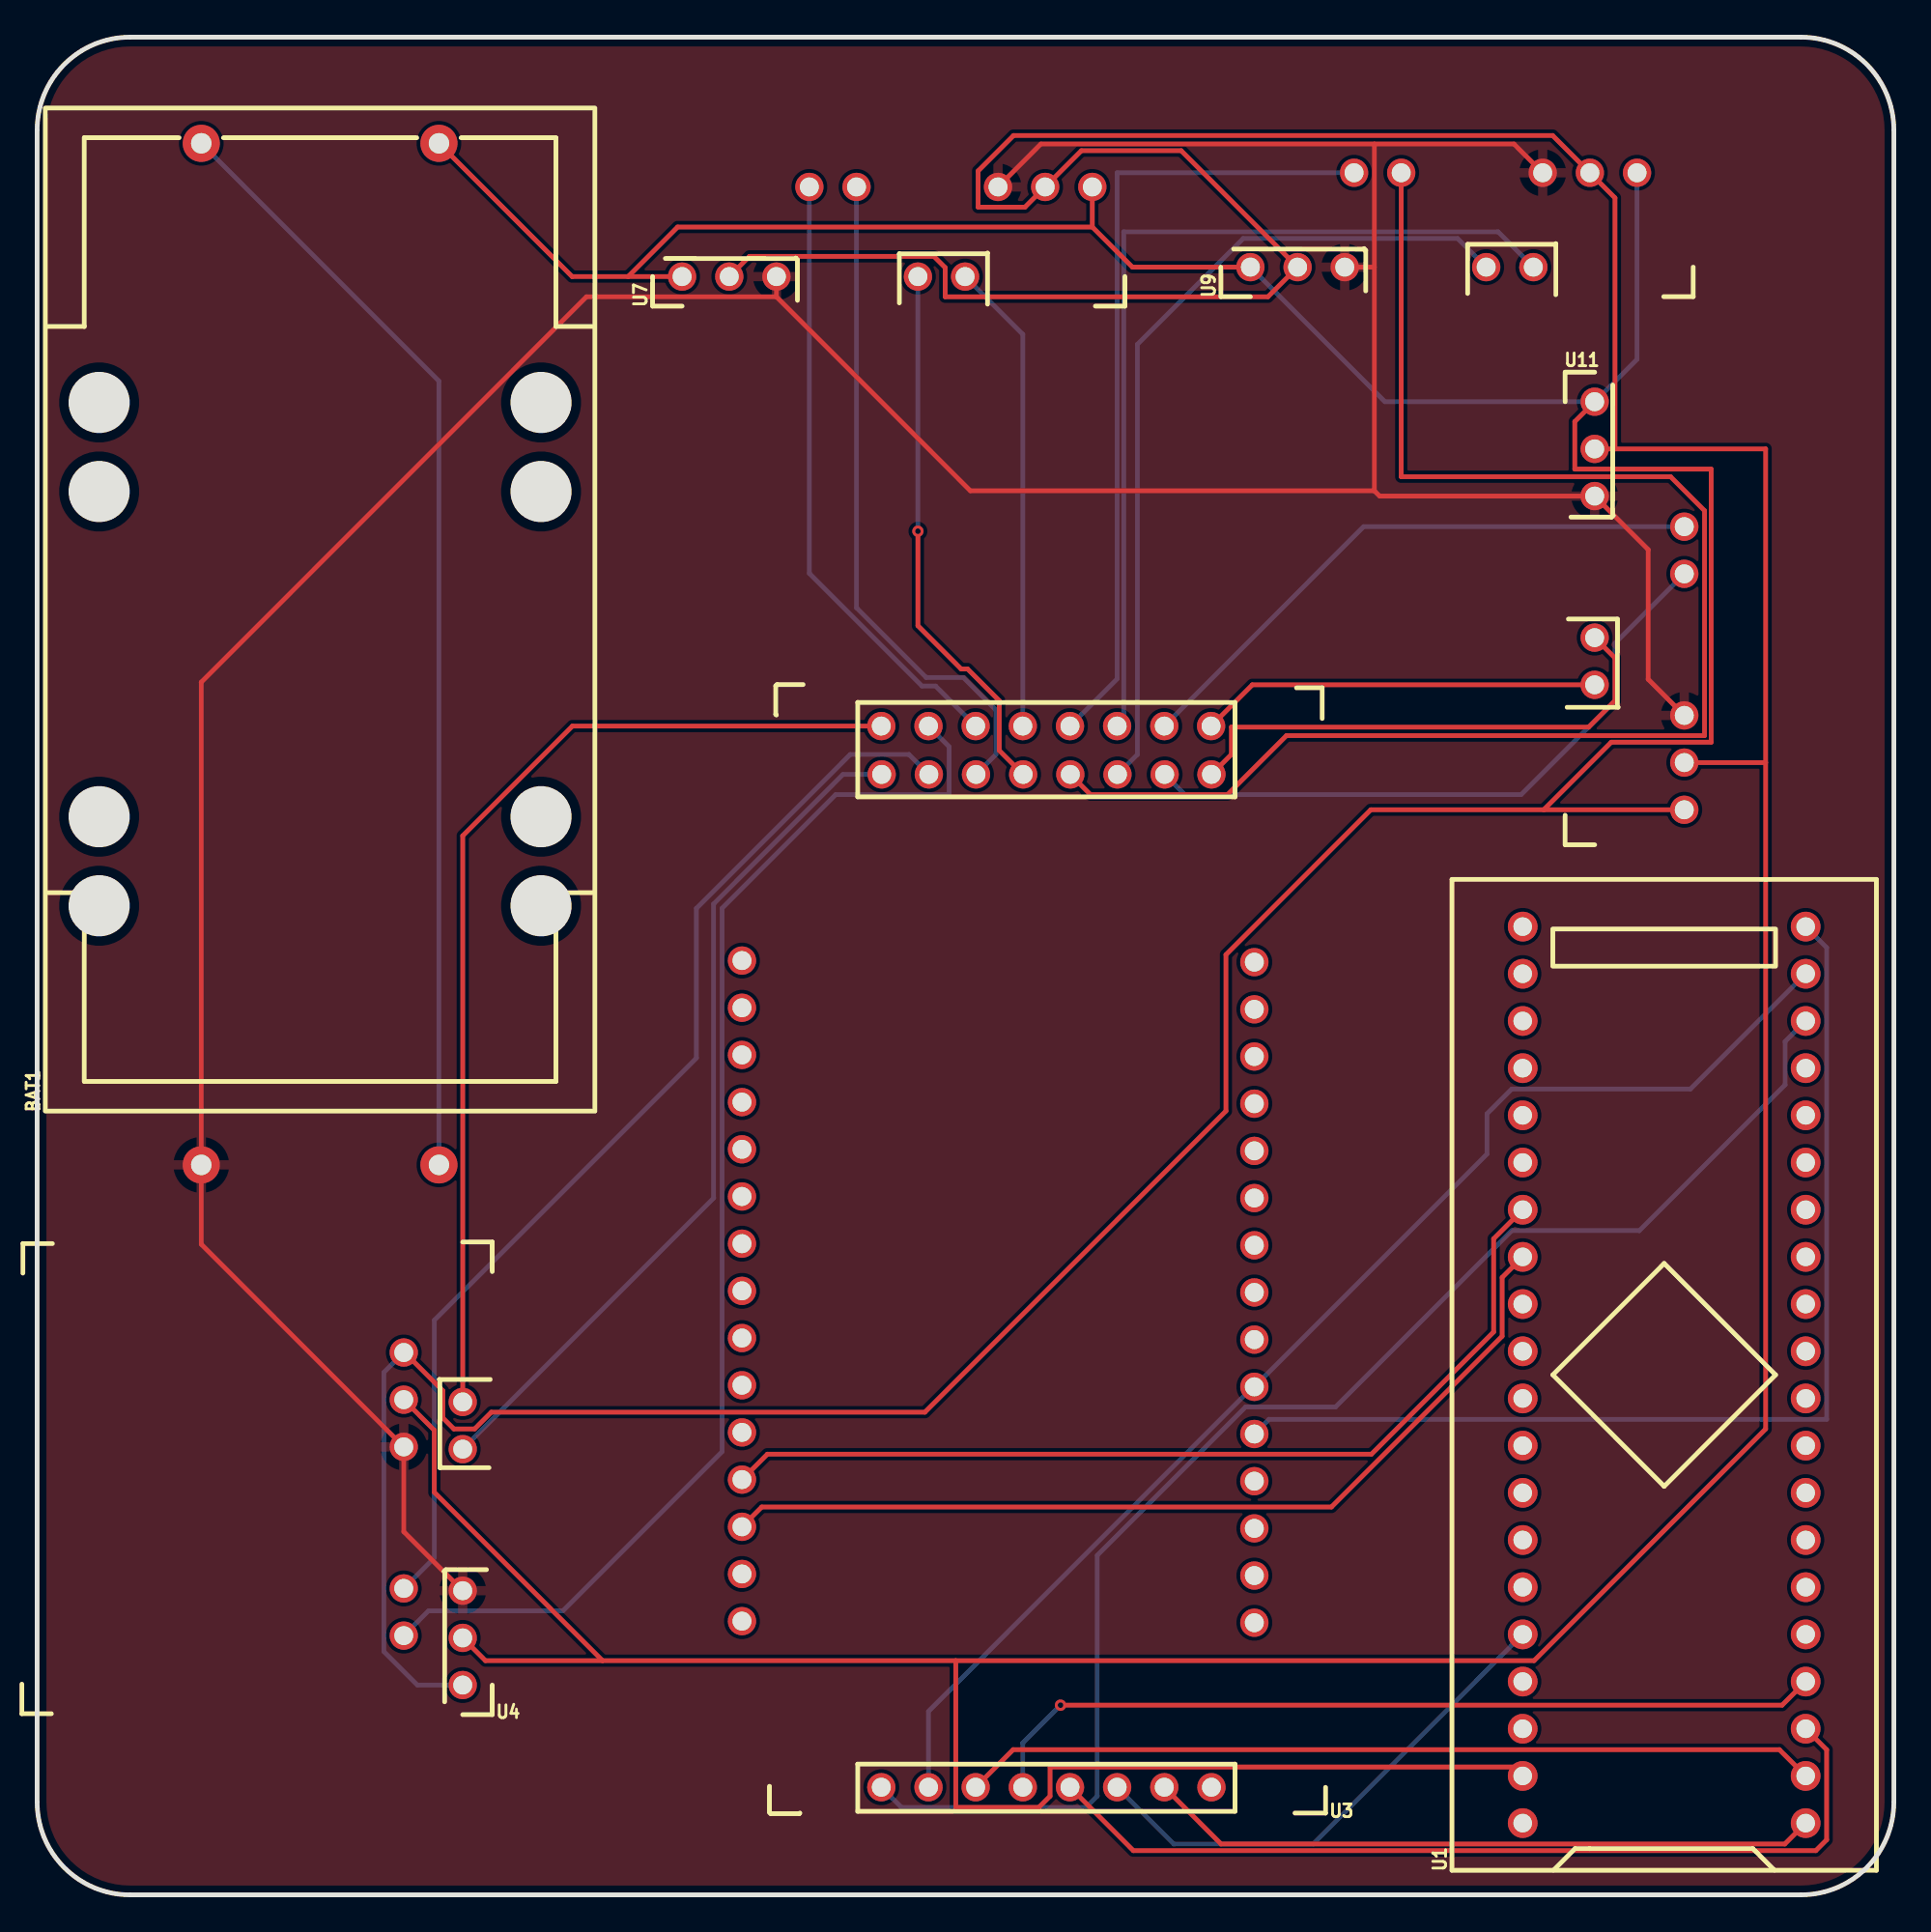
[diagram p10: board, top side]
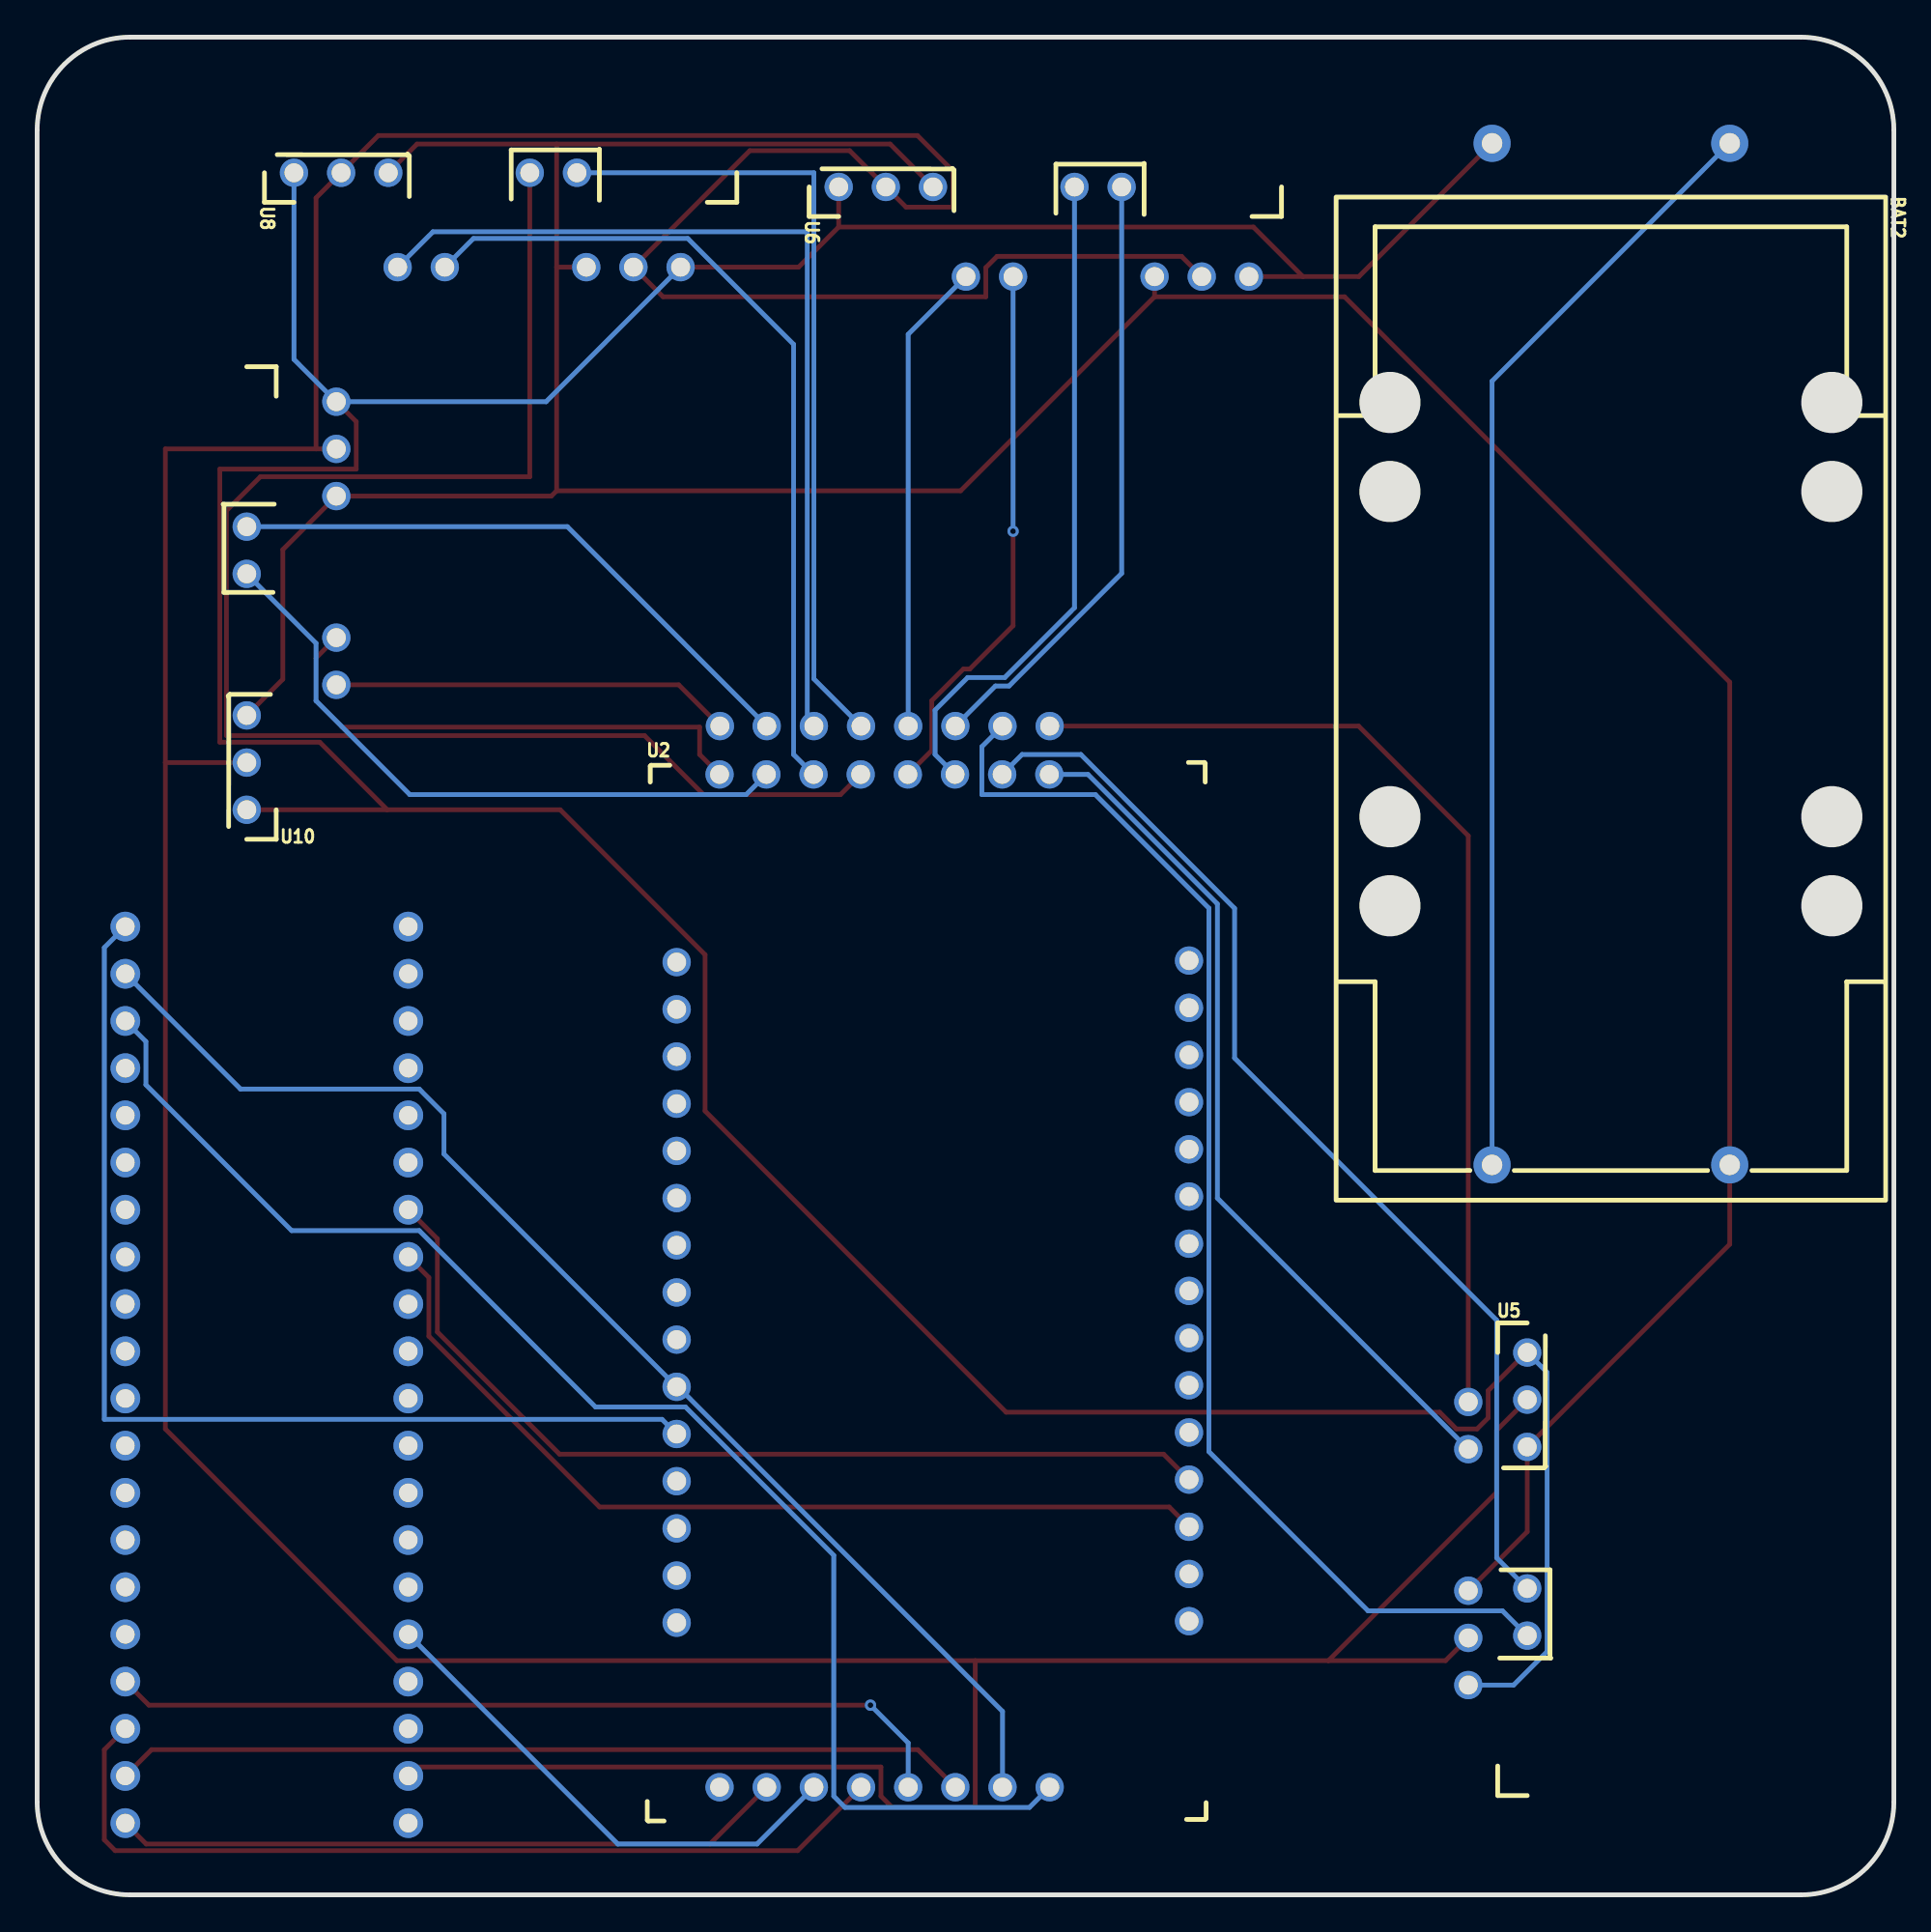
[diagram p11: board, bottom side, seen from below]

Outline 100 x 100 mm; copper layers: Top Layer, Bottom Layer. Coordinates in mm from the lower left corner of the outline.
Outline path: 0,95 0,5 arc(1.46,1.46) 5,0 95,0 arc(98.54,1.46) 100,5 100,95 arc(98.54,98.54) 95,100 5,100 arc(1.46,98.54) 0,95
Stack: Top Layer 0.035mm / Dielectric1 1.51mm FR4 er 4.5 / Bottom Layer 0.035mm

## Design rules (mm)
template: JLCPCB Capability(Two Layers Board)
spacing copperThickness1oz (default): track to track 0.102, other pairs 0.152 to 0.3
spacing copperThickness2oz: track to track 0.203, other pairs 0.152 to 0.3
track width copperThickness1oz (default): min 0.127, default 0.254, max 2.54
track width copperThickness2oz: min 0.203, default 0.254, max 2.54
differential pair differentialPair (default): width min 0.127, default 0.254, max 2.54; gap min 0.152, default 0.152
via viaSize (default): diameter min 0.5, default 0.61, max 10; hole min 0.3, default 0.305, max 6.3

## Placement (name value [footprint] x y rotation side)
BAT1  9VBatteryBox(BH-1294)  [BAT-TH_BH-1294]  15.24 94.28 90 top
BAT2  9VBatteryBox(BH-1294)  [BAT-TH_BH-1294]  15.24 39.29 270 bottom
U1  STM32F103C8T6-Card  [CONN-TH_L53.3-W22.9_STM32F103C8T6-CARD]  87.63 27.99 90 top
U2  -  [ESP8266]  67.18 3.99 180 bottom
U3  -  [ADS1256]  63.25 12.12 180 top
U4  -  [AD8226]  24.51 9.7 180 top
U5  -  [AD8226]  21.34 30.78 180 bottom
U6  -  [AD8226]  58.42 90.35 90 bottom
U7  -  [AD8226]  33.15 85.52 90 top
U8  -  [AD8226]  87.76 91.11 90 bottom
U9  -  [AD8226]  63.75 86.03 90 top
U10  -  [AD8226]  87.12 56.82 0 bottom
U11  -  [AD8226]  82.3 81.97 0 top

## Footprints (pads in the part's own frame, mm; a bottom-side part is the same pattern mirrored in y, then rotated)
AD8226
  round 1.524 hole 1.02: 1(1.59,-1.59) 2(1.59,-4.13) 3(1.59,-6.67) 4(1.59,-14.29) 5(1.59,-16.83)
ADS1256
  round 1.524 hole 1.02: 1(0,6.322) 2(2.54,6.322) 3(5.08,6.322) 4(7.62,6.322) 5(10.16,6.322) 6(12.7,6.322) 7(15.24,6.322) 8(17.78,6.322) 9(17.78,-50.8) 10(15.24,-50.8) 11(12.7,-50.8) 12(10.16,-50.8) 13(7.62,-50.8) 14(5.08,-50.8) 15(2.54,-50.8) 16(0.019,-50.801) 17(0,-48.198) 18(2.521,-48.197) 19(5.061,-48.197) 20(7.601,-48.197) 21(10.141,-48.197) 22(12.681,-48.197) 23(15.221,-48.197) 24(17.761,-48.197)
BAT-TH_BH-1294
  round 2 hole 1.1: 1(0,-6.4) 2(0,6.4)
CONN-TH_L53.3-W22.9_STM32F103C8T6-CARD
  round 1.6 hole 1: 1(-24.13,-7.62) 2(-21.59,-7.62) 3(-19.05,-7.62) 4(-16.51,-7.62) 5(-13.97,-7.62) 6(-11.43,-7.62) 7(-8.89,-7.62) 8(-6.35,-7.62) 9(-3.81,-7.62) 10(-1.27,-7.62) 11(1.27,-7.62) 12(3.81,-7.62) 13(6.35,-7.62) 14(8.89,-7.62) 15(11.43,-7.62) 16(13.97,-7.62) 17(16.51,-7.62) 18(19.05,-7.62) 19(21.59,-7.62) 20(24.13,-7.62) 21(24.13,7.62) 22(21.59,7.62) 23(19.05,7.62) 24(16.51,7.62) 25(13.97,7.62) 26(11.43,7.62) 27(8.89,7.62) 28(6.35,7.62) 29(3.81,7.62) 30(1.27,7.62) 31(-1.27,7.62) 32(-3.81,7.62) 33(-6.35,7.62) 34(-8.89,7.62) 35(-11.43,7.62) 36(-13.97,7.62) 37(-16.51,7.62) 38(-19.05,7.62) 39(-21.59,7.62) 40(-24.13,7.62)
ESP8266
  round 1.524 hole 1.02: 1(1.627,46.221) 2(1.627,43.681) 3(1.627,41.141) 4(1.627,38.6) 5(1.627,36.06) 6(1.627,33.52) 7(1.627,30.98) 8(1.627,28.441) 9(1.627,25.901) 10(1.627,23.36) 11(1.627,20.82) 12(1.627,18.28) 13(1.627,15.741) 14(1.627,13.2) 15(1.627,10.661) 16(29.221,46.306) 17(29.221,43.766) 18(29.221,41.225) 19(29.221,38.685) 20(29.221,36.145) 21(29.221,33.605) 22(29.221,31.066) 23(29.221,28.526) 24(29.221,25.985) 25(29.221,23.445) 26(29.221,20.905) 27(29.221,18.366) 28(29.221,15.825) 29(29.221,13.286) 30(29.221,10.745)

## Nets
As in the schematic.

Pads without a net: U1 5 6 7 8 9 10 11 12 13 14 15 16 17 21 22 23 24 25 26 29 30 31 32 33 34 35 37 38 40; U2 1 2 3 4 5 6 7 8 9 12 13 14 15 16 17 18 19 20 21 22 23 24 25 26 29 30; U3 1

## Via types
v1: diameter 0.61, hole 0.305, Top Layer to Bottom Layer, 2 vias

## Routing (per net, layer and track width the routed paths; a pad name or vN(x,y) marks a point on that pad's centre or on a via; arc(x,y) is an arc through that point)
5V_5V: length 76.7
  Bottom Layer w0.254: U3.8 46.55,4.71 56.49,4.71 57.09,5.31 57.09,18.28 65.08,26.26 69.93,26.26 79.42,35.76 86.29,35.76 94.14,43.61 94.14,45.93 95.25,47.04
GND0_GND: length 46.9
  Bottom Layer w0.254: U4.4 36.43,37.5 36.43,53.34 43.4,60.31 U3.24
GND1_GND: length 59.5
  Bottom Layer w0.254: U5.4 21.39,18.14 21.39,30.93 35.51,45.05 35.51,53.1 43.79,61.39 46.95,61.39 U3.23
GND2_GND: length 36.4
  Bottom Layer w0.254: U3.22 51.64,61.39 51.64,63.77 49.88,65.53 47.88,65.53 44.13,69.28 U6.4
GND3_GND: length 29.3
  Top Layer w0.254: U3.21 51.82,61.6 51.82,64.28 50.11,65.99 49.77,65.99 47.44,68.32 v1(47.44,73.4)
  Bottom Layer w0.254: v1(47.44,73.4) U7.4
GND4_GND: length 81.5
  Top Layer w0.254: U3.20 56.73,59.23 64.11,59.23 67.29,62.4 89.8,62.4 89.8,74.51 87.98,76.34 73.47,76.34 U8.4
GND5_GND: length 45.4
  Bottom Layer w0.254: U3.19 59.26,61.39 59.26,83.46 64.96,89.17 76.5,89.17 U9.4
GND6_GND: length 35.2
  Bottom Layer w0.254: U10.4 84.98,67.38 84.98,64.28 79.93,59.23 61.81,59.23 U3.18
GND7_GND: length 28.1
  Top Layer w0.254: U3.17 64.32,61.39 64.32,62.86 83.56,62.86 84.98,64.28 84.98,66.58 U11.4
GND_AD8266GND: length 307.7
  Top Layer w0.254: 93.09,60.95 93.09,77.84 84.98,77.84 ; 93.09,60.95 U10.2 ; 93.09,60.95 93.09,25.08 80.62,12.61 49.48,12.61 ; U1.39 79.53,6.88 54.55,6.88 54.55,5.31 53.95,4.71 49.48,4.71 49.48,12.61 ; 49.48,12.61 30.45,12.61 ; U4.2 24.15,12.61 30.45,12.61 ; U5.2 21.39,25.01 21.39,21.67 30.45,12.61 ; 84.98,77.84 84.98,91.35 U8.2 81.62,94.7 52.59,94.7 50.68,92.8 50.68,90.85 53.2,90.85 U6.2 56.24,93.89 61.61,93.89 U9.2 66.29,86.02 48.91,86.02 48.91,87.59 48.3,88.2 38.36,88.2 U7.2 ; 84.98,77.84 U11.2
VCC3V3_3V3: length 58.1
  Bottom Layer w0.254: 95.25,52.12 96.38,50.99 96.38,25.6 66.34,25.6 U2.11
AIN0_SIG: length 55.5
  Top Layer w0.254: 22.92,26.53 22.92,57.01 28.83,62.92 U3.9
AIN1_SIG: length 69.4
  Bottom Layer w0.254: U3.10 49.12,61.8 49.12,59.23 43,59.23 36.89,53.11 36.89,23.86 28.32,15.29 21.08,15.29 19.75,13.96
AIN2_SIG: length 33.2
  Bottom Layer w0.254: U3.11 48.39,65.07 47.66,65.07 41.59,71.14 U6.5
AIN3_SIG: length 25.5
  Bottom Layer w0.254: U7.5 53.09,84 U3.12
AIN4_SIG: length 43.6
  Bottom Layer w0.254: U8.5 58.17,92.7 58.17,65.46 U3.13
AIN5_SIG: length 49.6
  Bottom Layer w0.254: U9.5 78.68,89.52 58.52,89.52 58.52,63.27 U3.14
AIN6_SIG: length 32.5
  Bottom Layer w0.254: U3.15 71.44,73.65 U10.5
AIN7_SIG: length 21.6
  Top Layer w0.254: 63.23,62.92 65.45,65.14 U11.5
NEG_-VS: length 208.9
  Top Layer w0.254: U8.3 79.54,94.25 72.02,94.25 ; 72.02,87.62 72.02,94.25 ; 72.02,87.62 72.02,75.58 ; 72.02,87.62 U9.3 ; 72.02,94.25 54.06,94.25 U6.3 ; 72.02,75.58 72.3,75.3 U11.3 86.77,72.41 86.77,65.43 U10.3 ; 72.02,75.58 50.26,75.58 39.82,86.02 ; U4.3 19.75,19.55 U5.3 8.84,35.02 BAT2.2 8.84,65.28 29.59,86.02 39.82,86.02 ; 39.82,86.02 U7.3
PA2_RX: length 51
  Top Layer w0.254: U2.27 39.33,23.72 71.86,23.72 78.44,30.3 78.44,35.32 80.01,36.88
PA3_TX: length 49.9
  Top Layer w0.254: 80.01,34.34 78.9,33.23 78.9,30.07 69.71,20.88 39.03,20.88 U2.28
PB11_DRDY: length 27.8
  Bottom Layer w0.254: U3.3 61.22,2.74 68.73,2.74 80.01,14.02
PB12_CS: length 36.3
  Top Layer w0.254: 95.25,3.86 94.12,2.74 63.76,2.74 U3.2
PB13_SCLK: length 46.1
  Top Layer w0.254: U1.2 93.83,7.82 52.57,7.82 U3.6
PB14_DOUT: length 48.9
  Top Layer w0.254: U3.4 59.04,2.38 95.8,2.38 96.38,2.97 96.38,7.81 U1.3
PB15_DIN: length 45.9
  Top Layer w0.254: v1(55.12,10.21) 93.98,10.21 95.25,11.48
  Bottom Layer w0.254: v1(55.12,10.21) 53.09,8.18 U3.5
POS_+VS: length 237
  Top Layer w0.254: 81.14,58.41 84.78,62.05 90.16,62.05 90.16,76.75 82.81,76.75 82.81,79.31 U11.1 ; 81.14,58.41 71.83,58.41 64.03,50.61 64.03,42.2 47.81,25.98 24.46,25.98 23.56,25.08 22.44,25.08 21.85,25.67 21.85,27.14 19.79,29.19 U5.1 ; 81.14,58.41 U10.1 ; 31.83,87.11 34.5,89.78 56.83,89.78 ; 31.83,87.11 U7.1 ; 31.83,87.11 28.81,87.11 BAT1.1 ; U6.1 56.83,89.78 ; 56.83,89.78 58.99,87.62 U9.1
  Bottom Layer w0.254: U4.1 20.48,11.29 18.67,13.1 18.67,28.12 U5.1 ; U9.1 72.59,80.38 U11.1 86.17,82.66 U8.1
STM32GND_GND: length 69
  Bottom Layer w0.254: 95.25,49.58 89.05,43.38 79.42,43.38 78.09,42.04 78.09,39.88 U2.10 65.48,27.35 48.01,9.87 U3.7
$1N6178: length 60.3
  Bottom Layer w0.254: BAT1.2 21.64,81.48 BAT2.1

## Copper pours and planes (outline as drawn; the poured copper is in the pictures)
NEG_-VS on Top Layer: -4.95,101.65 102.23,101.65 102.23,-3.25 -4.95,-3.25
